# Altium project Smart Camera.PrjPcb (part 2 of 2)

## Sheet PoE FLYBACK.schdoc
size 510 x 296 mm
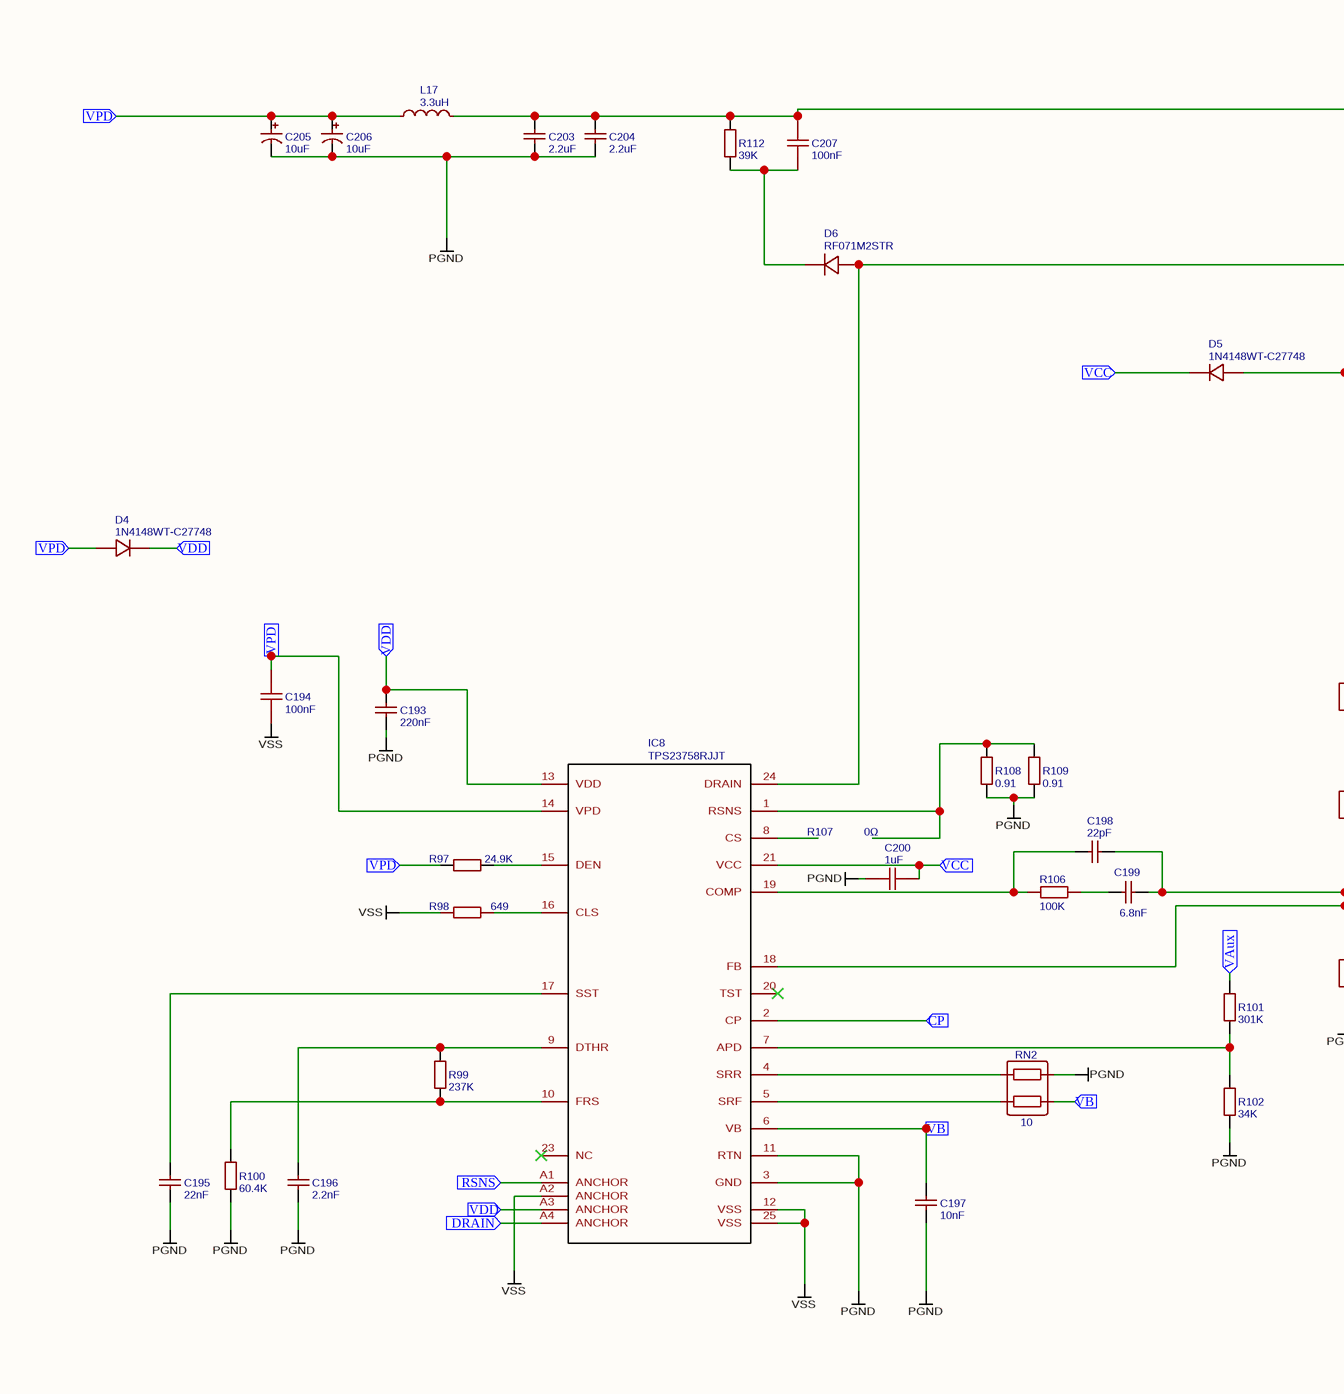
[diagram p11: PoE FLYBACK.schdoc, left]
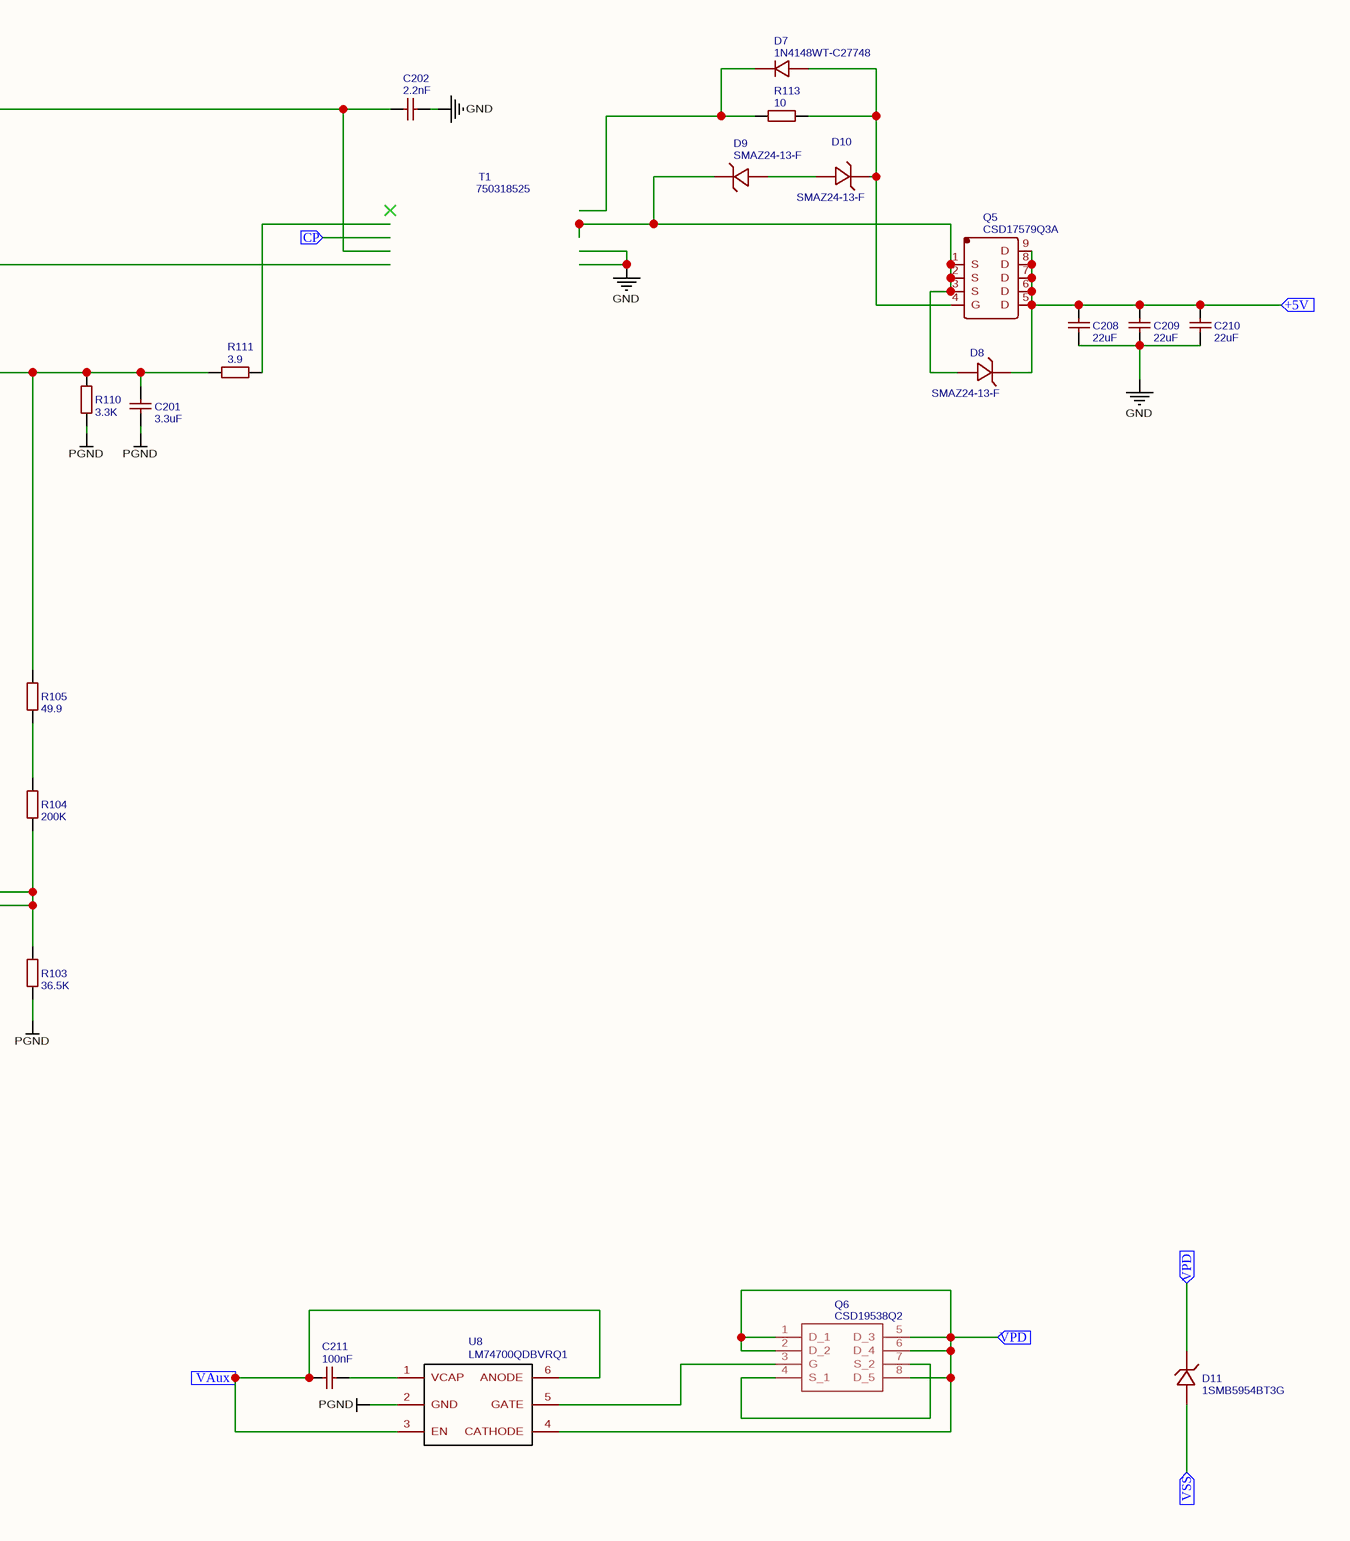
[diagram p12: PoE FLYBACK.schdoc, right]

### Parts
C193  220nF  [C0402]
C194  100nF  [C0603]
C195  22nF  [C0402]
C196  2.2nF  [C0402]
C197  10nF  [C0402]
C198  22pF  [C0402]
C199  6.8nF  [C0402]
C200  1uF  [C1206]
C201  3.3uF  [C0603]
C202  2.2nF  [C1206]
C203  2.2uF  [C1210]
C204  2.2uF  [C1210]
C205  10uF  [CAP-SMD_BD6.3-L6.6-W6.6-FD]
C206  10uF  [CAP-SMD_BD6.3-L6.6-W6.6-FD]
C207  100nF  [C0603]
C208  22uF  [C1206]
C209  22uF  [C1206]
C210  22uF  [C1206]
C211  100nF  [C0603]
D4  1N4148WT-C27748  [SOD-523_L1.2-W0.8-LS1.6-RD]
D5  1N4148WT-C27748  [SOD-523_L1.2-W0.8-LS1.6-RD]
D6  RF071M2STR  [SOD-123_L2.8-W1.8-LS3.7-RD]
D7  1N4148WT-C27748  [SOD-523_L1.2-W0.8-LS1.6-RD]
D8  SMAZ24-13-F  [SMA_L4.4-W2.6-LS5.0-RD]
D9  SMAZ24-13-F  [SMA_L4.4-W2.6-LS5.0-RD]
D10  SMAZ24-13-F  [SMA_L4.4-W2.6-LS5.0-RD]
D11  1SMB5954BT3G  [SMB_L4.6-W3.6-LS5.3-RD]
IC8  TPS23758RJJT  [TPS23758RJJT]
L17  3.3uH  [L0402]
Q5  CSD17579Q3A  [SON-8_L3.0-W3.1-P0.65-BP-EP]
Q6  CSD19538Q2  [CSD16301Q2]
R97  24.9K  [R0402]
R98  649  [R0402]
R99  237K  [R0402]
R100  60.4K  [R0402]
R101  301K  [R0402]
R102  34K  [R0402]
R103  36.5K  [R0402]
R104  200K  [R0402]
R105  49.9  [R0402]
R106  100K  [R0402]
R107  0Ω  [1206]
R108  0.91  [R0603]
R109  0.91  [R0603]
R110  3.3K  [R0402]
R111  3.9  [R0402]
R112  39K  [R0402]
R113  10  [R0603]
RN2  10  [RES-ARRAY-SMD_0402-4P-L1.0-W1.0-BL]
T1  750318525  [750318525]
U8  LM74700QDBVRQ1  [SOT-23-6]

### Ports
+5V (in), CP (in), DRAIN (in), RSNS (in), VAux (in), VB (in), VCC (in), VDD (in), VPD (in), VSS (in)

### Nets
GND: C202.2 C208.1 C209.1 C210.1
PGND: C193.1 C195.1 C196.1 C197.1 C200.2 C201.1 C203.1 C204.1 C205.2 C206.2 IC8.3(GND) IC8.11(RTN) R100.1 R102.1 R103.1 R108.1 R109.1 R110.1 RN2.4 U8.2(GND)
VSS: C194.1 IC8.12(VSS) IC8.25(VSS) IC8.A2(ANCHOR) R98.1
NetBR3_1: C194.2 C205.1 C206.1 D4.2(A) D11.1(C) IC8.14(VPD) L17.1 Q6.1(D_1) Q6.2(D_2) Q6.5(D_3) Q6.6(D_4) Q6.8(D_5) R97.1 U8.4(CATHODE) ; port VPD
NetC193_2: C193.2 D4.1(K) IC8.13(VDD) IC8.A3(ANCHOR) ; port VDD
NetC195_2: C195.2 IC8.17(SST)
NetC196_2: C196.2 IC8.9(DTHR) R99.2
NetC197_2: C197.2 IC8.6(VB) RN2.3 ; port VB
NetC198_1: C198.1 IC8.19(COMP) R106.1
NetC198_2: C198.2 C199.2 IC8.18(FB) R103.2 R104.1
NetC199_1: C199.1 R106.2
NetC200_1: C200.1 D5.1(K) IC8.21(VCC) ; port VCC
NetC201_2: C201.2 D5.2(A) R105.2 R110.2 R111.1
NetC202_1: C202.1 C203.2 C204.2 C207.2 L17.2 R112.2
NetC207_1: C207.1 D6.1(C) R112.1
NetC208_2: C208.2 C209.2 C210.2 D8.1(K) Q5.5(D) Q5.6(D) Q5.7(D) Q5.8(D) Q5.9(D) ; port +5V
NetC211_1: C211.1 R101.2 U8.3(EN) U8.6(ANODE) ; port VAux
NetC211_2: C211.2 U8.1(VCAP)
NetD6_2: D6.2(A) IC8.24(DRAIN)
NetD7_1: D7.1(K) R113.1
NetD7_2: D7.2(A) D10.1(K) Q5.4(G) R113.2
NetD8_2: D8.2(A) D9.1(K) Q5.1(S) Q5.2(S) Q5.3(S)
NetD9_2: D9.2(A) D10.2(A)
NetD11_2: D11.2(A) ; port VSS
NetIC8_1: IC8.1(RSNS) R108.2 R109.2
NetIC8_2: IC8.2(CP) ; port CP
NetIC8_4: IC8.4(SRR) RN2.1
NetIC8_5: IC8.5(SRF) RN2.2
NetIC8_7: IC8.7(APD) R101.1 R102.2
NetIC8_10: IC8.10(FRS) R99.1 R100.2
NetIC8_15: IC8.15(DEN) R97.2
NetIC8_16: IC8.16(CLS) R98.2
NetIC8_A1: IC8.A1(ANCHOR) ; port RSNS
NetIC8_A4: IC8.A4(ANCHOR) ; port DRAIN
NetQ6_3: Q6.3(G) U8.5(GATE)
NetQ6_4: Q6.4(S_1) Q6.7(S_2)
NetR104_2: R104.2 R105.1

Not connected (* = marked no-connect by the designer): IC8 8(CS) 20(TST)* 23(NC)*; R111 2

### Library data of the parts
C193 = 220nF: BOM_Manufacturer Part: CL05A224KA5NNNC; BOM_Manufacturer: SAMSUNG; nameAlias: Capacitance; SMT Type: Extend; BOM_Supplier: LCSC; BOM_Supplier Part: C47129; BOM_JLCPCB SMD: Yes; spicePre: C; spiceSymbolName: CL05A224KA5NNNC
C194 C207 = 100nF: BOM_Manufacturer: SAMSUNG; BOM_Manufacturer Part: CL10B104KC8NNNC; nameAlias: Capacitance; SMT Type: Extend; BOM_Supplier: LCSC; BOM_Supplier Part: C15725; BOM_JLCPCB SMD: Yes; spicePre: C; spiceSymbolName: CL10B104KC8NNNC
C195 = 22nF: BOM_Manufacturer: FH; BOM_Manufacturer Part: 0402B223K500NT; nameAlias: Capacitance; SMT Type: Basic; BOM_Supplier: LCSC; BOM_Supplier Part: C1532; BOM_JLCPCB SMD: Yes; spicePre: C; spiceSymbolName: 0402B223K500NT
C196 = 2.2nF: BOM_Manufacturer: FH; BOM_Manufacturer Part: 0402B222K500NT; nameAlias: Capacitance; SMT Type: Basic; BOM_Supplier: LCSC; BOM_Supplier Part: C1531; BOM_JLCPCB SMD: Yes; spicePre: C; spiceSymbolName: 0402B222K500NT
C197 = 10nF: BOM_Manufacturer Part: CL05B103KB5NNNC; BOM_Manufacturer: SAMSUNG; nameAlias: Capacitance; SMT Type: Basic; BOM_Supplier: LCSC; BOM_Supplier Part: C15195; BOM_JLCPCB SMD: Yes; spicePre: C; spiceSymbolName: CL05B103KB5NNNC
C198 = 22pF: BOM_Manufacturer: FH; BOM_Manufacturer Part: 0402CG220J500NT; nameAlias: Capacitance; SMT Type: Basic; BOM_Supplier: LCSC; BOM_Supplier Part: C1555; BOM_JLCPCB SMD: Yes; spicePre: C; spiceSymbolName: 0402CG220J500NT
C199 = 6.8nF: BOM_Manufacturer: FH; BOM_Manufacturer Part: 0402B682K500NT; nameAlias: Capacitance; SMT Type: Basic; BOM_Supplier: LCSC; BOM_Supplier Part: C1542; BOM_JLCPCB SMD: Yes; spicePre: C; spiceSymbolName: 0402B682K500NT
C200 = 1uF: BOM_Manufacturer: SAMSUNG; BOM_Manufacturer Part: CL31B105KCHNNNE; nameAlias: Capacitance; SMT Type: Extend; BOM_Supplier: LCSC; BOM_Supplier Part: C13832; BOM_JLCPCB SMD: Yes; spicePre: C; spiceSymbolName: CL31B105KCHNNNE
C201 = 3.3uF: BOM_Manufacturer Part: CL10A335KP8NNNC; BOM_Manufacturer: SAMSUNG; nameAlias: Capacitance; SMT Type: Extend; BOM_Supplier: LCSC; BOM_Supplier Part: C51412; BOM_JLCPCB SMD: Yes; spicePre: C; spiceSymbolName: CL10A335KP8NNNC
C202 = 2.2nF: BOM_Manufacturer: FH; BOM_Manufacturer Part: 1206B222K202NT; nameAlias: Capacitance; SMT Type: Extend; BOM_Supplier: LCSC; BOM_Supplier Part: C41018; BOM_JLCPCB SMD: Yes; spicePre: C; spiceSymbolName: 1206B222K202NT
C203 C204 = 2.2uF: BOM_Manufacturer Part: CL32B225KCJSNNE; BOM_Manufacturer: SAMSUNG; nameAlias: Capacitance; BOM_Supplier: LCSC; BOM_Supplier Part: C55151; spicePre: C; spiceSymbolName: CL32B225KCJSNNE
C205 C206 = 10uF: BOM_Manufacturer: CHENGX; BOM_Manufacturer Part: UT2A100M0607VG; nameAlias: Capacitance; BOM_Supplier: LCSC; BOM_Supplier Part: C82005; spicePre: C; spiceSymbolName: UT2A100M0607VG
C208-C210 = 22uF: BOM_Manufacturer Part: CL31A226KAHNNNE; BOM_Manufacturer: SAMSUNG; nameAlias: Capacitance; SMT Type: Extend; BOM_Supplier: LCSC; BOM_Supplier Part: C12891; BOM_JLCPCB SMD: Yes; spicePre: C; spiceSymbolName: CL31A226KAHNNNE
C211 = 100nF: BOM_Manufacturer Part: CL10B104JB8NNNC; BOM_Manufacturer: SAMSUNG; nameAlias: Capacitance; SMT Type: Extend; BOM_Supplier: LCSC; BOM_Supplier Part: C24452; BOM_JLCPCB SMD: Yes; spicePre: C; spiceSymbolName: CL10B104JB8NNNC
D4 D5 D7 = 1N4148WT-C27748: BOM_Manufacturer: SEMTECH; SMT Type: Extend; BOM_Supplier: LCSC; BOM_Manufacturer Part: 1N4148WT; image: //image.lceda.cn/szlcsc/C27748.jpg; BOM_Supplier Part: C27748; BOM_JLCPCB SMD: Yes; spicePre: D; spiceSymbolName: 1N4148WT-C27748
D6 = RF071M2STR: BOM_Manufacturer: ROHM; SMT Type: Extend; BOM_Supplier: LCSC; BOM_Manufacturer Part: RF071M2STR; image: //image.lceda.cn/szlcsc/C84978.jpg; BOM_Supplier Part: C84978; BOM_JLCPCB SMD: Yes; spicePre: D; spiceSymbolName: RF071M2STR
D8-D10 = SMAZ24-13-F: BOM_Manufacturer: Diodes Incorporated; Contributor: LCSC; SMT Type: Extend; BOM_Supplier: LCSC; BOM_Supplier Part: C155317; BOM_Manufacturer Part: SMAZ24-13-F; BOM_JLCPCB SMD: Yes; spicePre: D; spiceSymbolName: SMAZ24-13-F
D11 = 1SMB5954BT3G: BOM_Manufacturer: ON Semicon; Contributor: LCSC; SMT Type: Extend; BOM_Supplier: LCSC; BOM_Supplier Part: C235980; BOM_Manufacturer Part: 1SMB5954BT3G; BOM_JLCPCB SMD: Yes; spicePre: D; spiceSymbolName: 1SMB5954BT3G
IC8 = TPS23758RJJT: Contributor: Ke'Ondrae_Mell; spicePre: I; spiceSymbolName: TPS23758RJJT
L17 = 3.3uH: BOM_Manufacturer Part: SDFL1005Q3R3KTF; BOM_Manufacturer: Sunlord; nameAlias: Inductance; SMT Type: Extend; BOM_Supplier: LCSC; BOM_Supplier Part: C84474; BOM_JLCPCB SMD: Yes; spicePre: L; spiceSymbolName: SDFL1005Q3R3KTF
Q5 = CSD17579Q3A: BOM_Manufacturer: Texas Instruments; Contributor: LCSC; BOM_Supplier: LCSC; BOM_Supplier Part: C97376; BOM_Manufacturer Part: CSD17579Q3A; spicePre: Q; spiceSymbolName: CSD17579Q3A
R97 = 24.9K: BOM_Manufacturer: UniOhm; BOM_Manufacturer Part: 0402WGF2492TCE; nameAlias: Resistance (Ohms); SMT Type: Extend; BOM_Supplier: LCSC; BOM_Supplier Part: C25874; BOM_JLCPCB SMD: Yes; spicePre: R; spiceSymbolName: 0402WGF2492TCE
R98 = 649: BOM_Manufacturer: Uniroyal Elec; BOM_Manufacturer Part: 0402WGF6490TCE; nameAlias: Resistance (Ohms); Contributor: LCSC; SMT Type: Extend; BOM_Supplier: LCSC; BOM_Supplier Part: C82294; BOM_JLCPCB SMD: Yes; spicePre: R; spiceSymbolName: 0402WGF6490TCE
R99 = 237K: BOM_Manufacturer: UniOhm; BOM_Manufacturer Part: 0402WGF2373TCE; nameAlias: Resistance (Ohms); SMT Type: Extend; BOM_Supplier: LCSC; BOM_Supplier Part: C27001; BOM_JLCPCB SMD: Yes; spicePre: R; spiceSymbolName: 0402WGF2373TCE
R100 = 60.4K: BOM_Manufacturer: UniOhm; BOM_Manufacturer Part: 0402WGF6042TCE; nameAlias: Resistance (Ohms); SMT Type: Extend; BOM_Supplier: LCSC; BOM_Supplier Part: C25911; BOM_JLCPCB SMD: Yes; spicePre: R; spiceSymbolName: 0402WGF6042TCE
R101 = 301K: BOM_Manufacturer: UniOhm; BOM_Manufacturer Part: 0402WGF3013TCE; nameAlias: Resistance (Ohms); SMT Type: Extend; BOM_Supplier: LCSC; BOM_Supplier Part: C25775; BOM_JLCPCB SMD: Yes; spicePre: R; spiceSymbolName: 0402WGF3013TCE
R102 = 34K: BOM_Manufacturer: UniOhm; BOM_Manufacturer Part: 0402WGF3402TCE; nameAlias: Resistance (Ohms); SMT Type: Extend; BOM_Supplier: LCSC; BOM_Supplier Part: C48939; BOM_JLCPCB SMD: Yes; spicePre: R; spiceSymbolName: 0402WGF3402TCE
R103 = 36.5K: BOM_Manufacturer: UniOhm; BOM_Manufacturer Part: 0402WGF3652TCE; nameAlias: Resistance (Ohms); SMT Type: Extend; BOM_Supplier: LCSC; BOM_Supplier Part: C25887; BOM_JLCPCB SMD: Yes; spicePre: R; spiceSymbolName: 0402WGF3652TCE
R104 = 200K: BOM_Manufacturer: UniOhm; BOM_Manufacturer Part: 0402WGF2003TCE; nameAlias: Resistance (Ohms); SMT Type: Basic; BOM_Supplier: LCSC; BOM_Supplier Part: C25764; BOM_JLCPCB SMD: Yes; spicePre: R; spiceSymbolName: 0402WGF2003TCE
R105 = 49.9: BOM_Manufacturer: UniOhm; BOM_Manufacturer Part: 0402WGF499JTCE; nameAlias: Resistance (Ohms); SMT Type: Basic; BOM_Supplier: LCSC; BOM_Supplier Part: C25120; BOM_JLCPCB SMD: Yes; spicePre: R; spiceSymbolName: 0402WGF499JTCE
R106 = 100K: BOM_Manufacturer: Uniroyal Elec; BOM_Manufacturer Part: 0402WGD1003TCE; nameAlias: Resistance (Ohms); Contributor: LCSC; SMT Type: Extend; BOM_Supplier: LCSC; BOM_Supplier Part: C270658; BOM_JLCPCB SMD: Yes; spicePre: R; spiceSymbolName: 0402WGD1003TCE
R107 = 0Ω: BOM_Manufacturer Part: 0R(000) ±1%; Value: 0Ω; BOM_Supplier Part: undefined; BOM_Supplier: LCSC; spicePre: R; spiceSymbolName: 0Ω
R108 R109 = 0.91: BOM_Manufacturer: UniOhm; BOM_Manufacturer Part: 0603WAF910LT5E; nameAlias: Resistance (Ohms); SMT Type: Extend; BOM_Supplier: LCSC; BOM_Supplier Part: C27867; BOM_JLCPCB SMD: Yes; spicePre: R; spiceSymbolName: 0603WAF910LT5E
R110 = 3.3K: BOM_Manufacturer: UniOhm; BOM_Manufacturer Part: 0402WGF3301TCE; nameAlias: Resistance (Ohms); SMT Type: Basic; BOM_Supplier: LCSC; BOM_Supplier Part: C25890; BOM_JLCPCB SMD: Yes; spicePre: R; spiceSymbolName: 0402WGF3301TCE
R111 = 3.9: BOM_Manufacturer: UniOhm; BOM_Manufacturer Part: 0402WGF390KTCE; nameAlias: Resistance (Ohms); SMT Type: Extend; BOM_Supplier: LCSC; BOM_Supplier Part: C44937; BOM_JLCPCB SMD: Yes; spicePre: R; spiceSymbolName: 0402WGF390KTCE
R112 = 39K: BOM_Manufacturer: UniOhm; BOM_Manufacturer Part: 0402WGF3902TCE; nameAlias: Resistance (Ohms); SMT Type: Basic; BOM_Supplier: LCSC; BOM_Supplier Part: C25783; BOM_JLCPCB SMD: Yes; spicePre: R; spiceSymbolName: 0402WGF3902TCE
R113 = 10: BOM_Manufacturer: UniOhm; BOM_Manufacturer Part: TC0325B100JT5E; nameAlias: Resistance (Ohms); Contributor: LCSC; SMT Type: Extend; BOM_Supplier: LCSC; BOM_Supplier Part: C146565; BOM_JLCPCB SMD: Yes; spicePre: R; spiceSymbolName: TC0325B100JT5E
RN2 = 10: BOM_Manufacturer: Uniroyal Elec; BOM_Manufacturer Part: 2D02WGJ0100TCE; nameAlias: Resistance (Ohms); Contributor: LCSC; SMT Type: Extend; BOM_Supplier: LCSC; BOM_Supplier Part: C270394; BOM_JLCPCB SMD: Yes; spicePre: R; spiceSymbolName: 2D02WGJ0100TCE
U8 = LM74700QDBVRQ1: BOM_Manufacturer: Texas Instruments; Contributor: energybank; BOM_Manufacturer Part: LM74700QDBVRQ1; BOM_Supplier: Digi-Key; BOM_Supplier Part: 296-LM74700QDBVRQ1CT-ND; link: http://www.ti.com/general/docs/suppproductinfo.tsp?distId=10&gotoUrl=http%3A%2F%2Fwww.ti.com%2Flit%2Fgpn%2Flm74700-q1; spicePre: U; spiceSymbolName: LM74700QDBVRQ1
Q6 = CSD19538Q2: spicePre: Q; spiceSymbolName: CSD19538Q2
T1 = 750318525: spicePre: T; spiceSymbolName: 750318525

## Sheet PoE.schdoc
size 518 x 329 mm
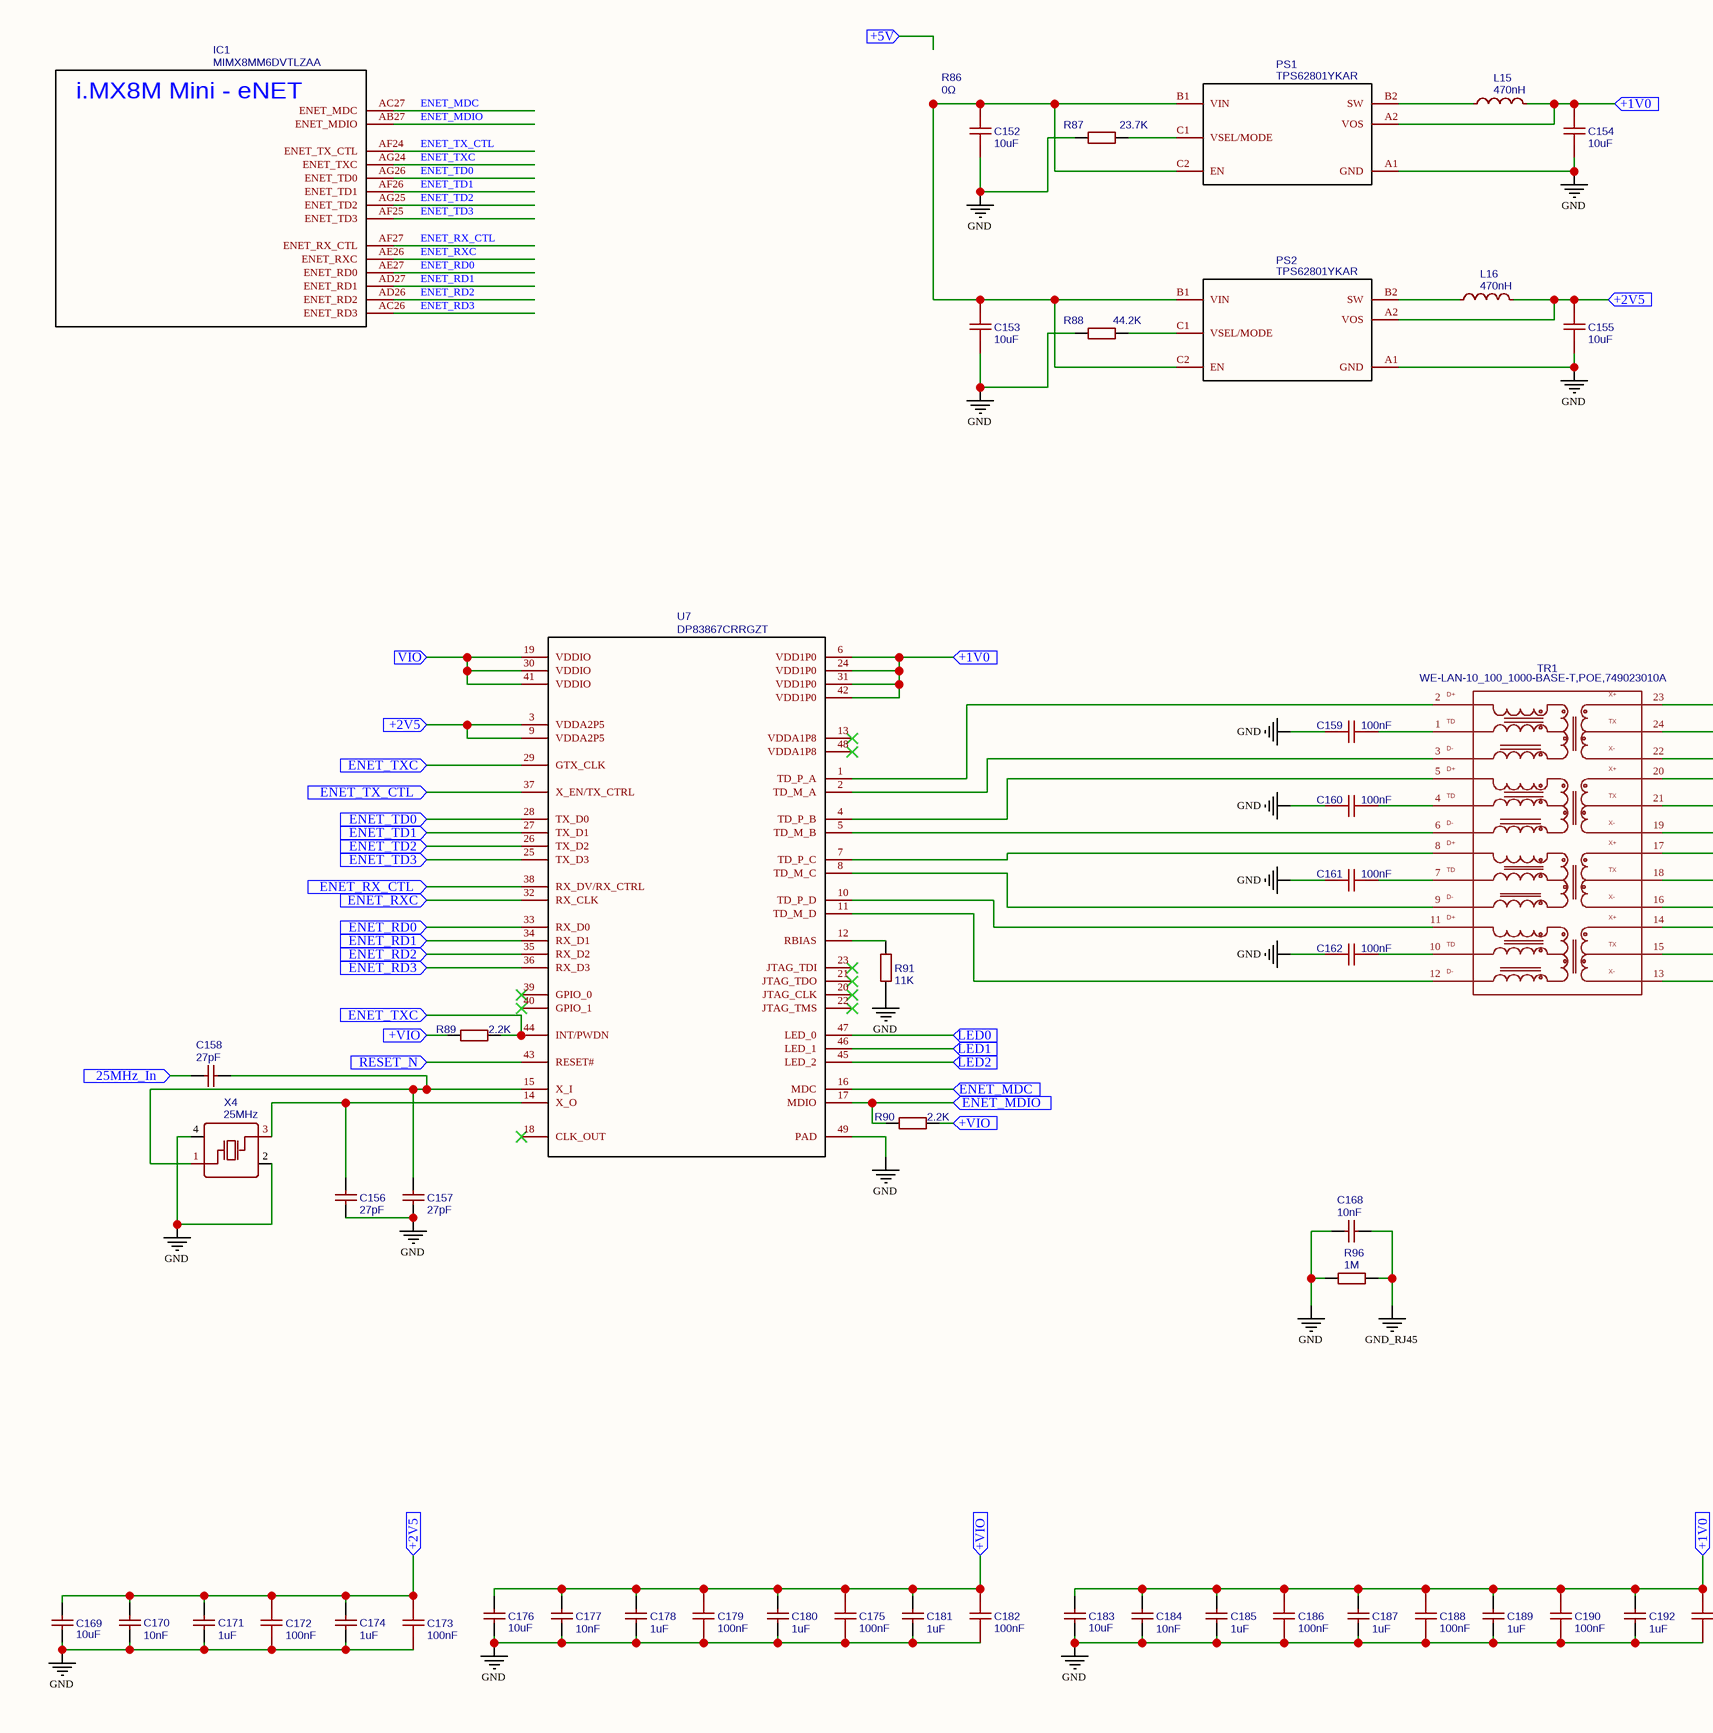
[diagram p13: PoE.schdoc, left]
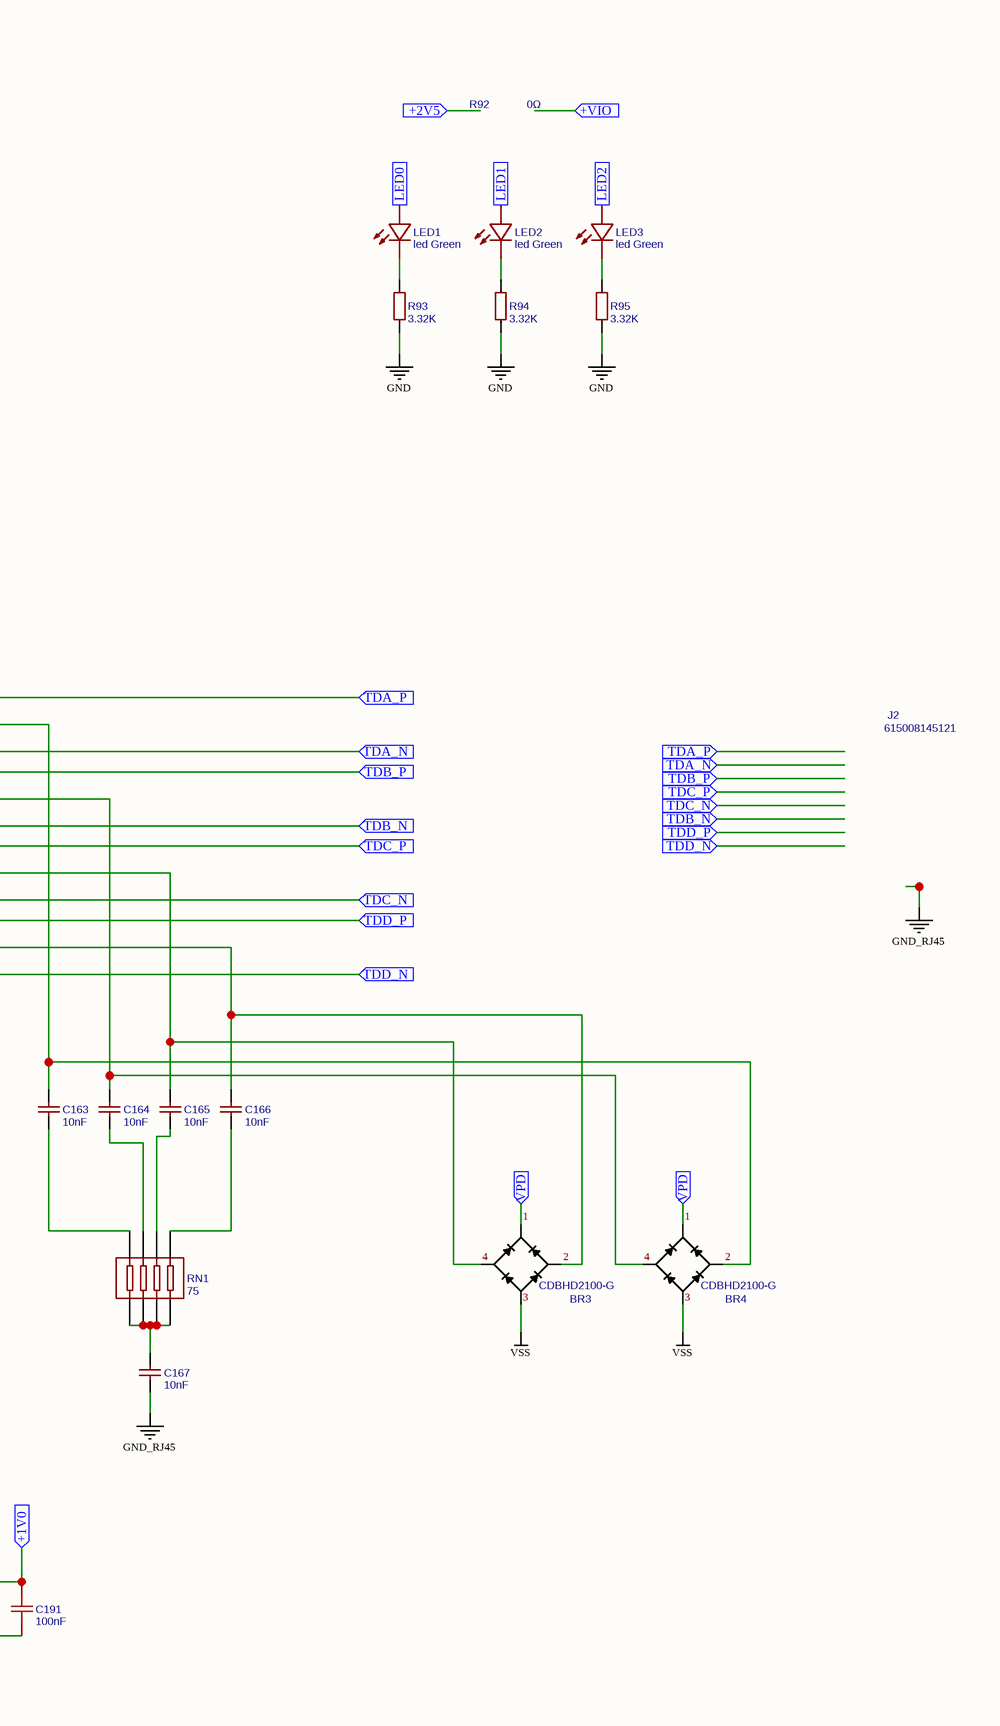
[diagram p14: PoE.schdoc, right]

### Parts
(Parts that share a designator on the sheet are numbered #1, #2 ... from top to bottom, then left to right.)
BR3  CDBHD2100-G  [SOP250P700X290-4N]
BR4  CDBHD2100-G  [SOP250P700X290-4N]
C152  10uF  [C1206]
C153  10uF  [C1206]
C154  10uF  [C1206]
C155  10uF  [C1206]
C156  27pF  [C0402]
C157  27pF  [C0402]
C158  27pF  [C0402]
C159  100nF  [C0603]
C160  100nF  [C0603]
C161  100nF  [C0603]
C162  100nF  [C0603]
C163  10nF  [C0805]
C164  10nF  [C0805]
C165  10nF  [C0805]
C166  10nF  [C0805]
C167  10nF  [C1206]
C168  10nF  [C1206]
C169  10uF  [C0402]
C170  10nF  [C0402]
C171  1uF  [C0603]
C172  100nF  [C0603]
C173  100nF  [C0603]
C174  1uF  [C0603]
C175  100nF  [C0603]
C176  10uF  [C0402]
C177  10nF  [C0402]
C178  1uF  [C0603]
C179  100nF  [C0603]
C180  1uF  [C0603]
C181  1uF  [C0603]
C182  100nF  [C0603]
C183  10uF  [C0402]
C184  10nF  [C0402]
C185  1uF  [C0603]
C186  100nF  [C0603]
C187  1uF  [C0603]
C188  100nF  [C0603]
C189  1uF  [C0603]
C190  100nF  [C0603]
C191  100nF  [C0603]
C192  1uF  [C0603]
IC1#11  MIMX8MM6DVTLZAA  [BGA486C50P27X27_1400X1400X125]
J2  615008145121  [615008145121]
L15  470nH  [L0603]
L16  470nH  [L0603]
LED1  led Green  [LED1206-RD]
LED2  led Green  [LED1206-RD]
LED3  led Green  [LED1206-RD]
PS1  TPS62801YKAR  [BGA6C35P2X3_70X105X40]
PS2  TPS62801YKAR  [BGA6C35P2X3_70X105X40]
R86  0Ω  [1206]
R87  23.7K  [R0402]
R88  44.2K  [R0402]
R89  2.2K  [R0402]
R90  2.2K  [R0402]
R91  11K  [R0402]
R92  0Ω  [1206]
R93  3.32K  [R0402]
R94  3.32K  [R0402]
R95  3.32K  [R0402]
R96  1M  [R0402]
RN1  75  [RES-ARRAY-SMD_0402-8P-L2.0-W1.0-BL]
TR1  WE-LAN-10_100_1000-BASE-T,POE,749023010A  [749023010A]
U7  DP83867CRRGZT  [QFN50P700X700X100-49N]
X4  25MHz  [OSC-SMD_4P-L3.2-W2.5-BL]

### Ports
25MHz_In (in), +1V0 (in), +2V5 (in), +5V (in), +VIO (in), ENET_MDC (in), ENET_MDIO (in), ENET_RD0 (in), ENET_RD1 (in), ENET_RD2 (in), ENET_RD3 (in), ENET_RX_CTL (in), ENET_RXC (in), ENET_TD0 (in), ENET_TD1 (in), ENET_TD2 (in), ENET_TD3 (in), ENET_TX_CTL (in), ENET_TXC (in), LED0 (in), LED1 (in), LED2 (in), RESET_N (in), TDA_N (in), TDA_P (in), TDB_N (in), TDB_P (in), TDC_N (in), TDC_P (in), TDD_N (in), TDD_P (in), VIO (in), VPD (in)

### Nets
GND: C152.1 C153.1 C154.1 C155.1 C156.1 C157.1 C159.1 C160.1 C161.1 C162.1 C168.2 C169.1 C170.1 C171.1 C172.1 C173.1 C174.1 C175.1 C176.1 C177.1 C178.1 C179.1 C180.1 C181.1 C182.1 C183.1 C184.1 C185.1 C186.1 C187.1 C188.1 C189.1 C190.1 C191.1 C192.1 PS1.A1(GND) PS2.A1(GND) R87.1 R88.1 R91.1 R93.1 R94.1 R95.1 R96.1 U7.49(PAD) X4.2(GND) X4.4(GND)
GND_RJ45: C167.1 C168.1 R96.2
VSS: BR3.3 BR4.3
ENET_MDC: IC1#11.AC27(ENET_MDC)
ENET_MDIO: IC1#11.AB27(ENET_MDIO)
ENET_RD0: IC1#11.AE27(ENET_RD0)
ENET_RD1: IC1#11.AD27(ENET_RD1)
ENET_RD2: IC1#11.AD26(ENET_RD2)
ENET_RD3: IC1#11.AC26(ENET_RD3)
ENET_RX_CTL: IC1#11.AF27(ENET_RX_CTL)
ENET_RXC: IC1#11.AE26(ENET_RXC)
ENET_TD0: IC1#11.AG26(ENET_TD0)
ENET_TD1: IC1#11.AF26(ENET_TD1)
ENET_TD2: IC1#11.AG25(ENET_TD2)
ENET_TD3: IC1#11.AF25(ENET_TD3)
ENET_TX_CTL: IC1#11.AF24(ENET_TX_CTL)
ENET_TXC: IC1#11.AG24(ENET_TXC)
NetBR3_1: BR3.1 BR4.1 ; port VPD
NetBR3_2: BR3.2 C166.2 TR1.15
NetBR3_4: BR3.4 C165.2 TR1.18
NetBR4_2: BR4.2 C163.2 TR1.24
NetBR4_4: BR4.4 C164.2 TR1.21
NetC152_2: C152.2 C153.2 PS1.B1(VIN) PS1.C2(EN) PS2.B1(VIN) PS2.C2(EN)
NetC154_2: C154.2 C183.2 C184.2 C185.2 C186.2 C187.2 C188.2 C189.2 C190.2 C191.2 C192.2 L15.2 PS1.A2(VOS) U7.6(VDD1P0) U7.24(VDD1P0) U7.31(VDD1P0) U7.42(VDD1P0) ; port +1V0
NetC155_2: C155.2 C169.2 C170.2 C171.2 C172.2 C173.2 C174.2 L16.2 PS2.A2(VOS) U7.3(VDDA2P5) U7.9(VDDA2P5) ; port +2V5
NetC156_2: C156.2 U7.14(X_O) X4.3(OSC2)
NetC157_2: C157.2 C158.1 U7.15(X_I) X4.1(OSC1)
NetC158_2: C158.2 ; port 25MHz_In
NetC159_2: C159.2 TR1.1
NetC160_2: C160.2 TR1.4
NetC161_2: C161.2 TR1.7
NetC162_2: C162.2 TR1.10
NetC163_1: C163.1 RN1.8
NetC164_1: C164.1 RN1.7
NetC165_1: C165.1 RN1.6
NetC166_1: C166.1 RN1.5
NetC167_2: C167.2 RN1.1 RN1.2 RN1.3 RN1.4
NetC175_2: C175.2 C176.2 C177.2 C178.2 C179.2 C180.2 C181.2 C182.2 R89.1 R90.2 ; port +VIO
NetL15_1: L15.1 PS1.B2(SW)
NetL16_1: L16.1 PS2.B2(SW)
NetLED1_1: LED1.1(-) R93.2
NetLED1_2: LED1.2(+) U7.47(LED_0) ; port LED0
NetLED2_1: LED2.1(-) R94.2
NetLED2_2: LED2.2(+) U7.46(LED_1) ; port LED1
NetLED3_1: LED3.1(-) R95.2
NetLED3_2: LED3.2(+) U7.45(LED_2) ; port LED2
NetPS1_C1: PS1.C1(VSEL/MODE) R87.2
NetPS2_C1: PS2.C1(VSEL/MODE) R88.2
NetR89_2: R89.2 U7.29(GTX_CLK) U7.44(INT/PWDN) ; port ENET_TXC
NetR90_1: R90.1 U7.17(MDIO) ; port ENET_MDIO
NetR91_2: R91.2 U7.12(RBIAS)
NetTR1_2: TR1.2 U7.1(TD_P_A)
NetTR1_3: TR1.3 U7.2(TD_M_A)
NetTR1_5: TR1.5 U7.4(TD_P_B)
NetTR1_6: TR1.6 U7.5(TD_M_B)
NetTR1_8: TR1.8 U7.7(TD_P_C)
NetTR1_9: TR1.9 U7.8(TD_M_C)
NetTR1_11: TR1.11 U7.10(TD_P_D)
NetTR1_12: TR1.12 U7.11(TD_M_D)
NetTR1_13: TR1.13 ; port TDD_N
NetTR1_14: TR1.14 ; port TDD_P
NetTR1_16: TR1.16 ; port TDC_N
NetTR1_17: TR1.17 ; port TDC_P
NetTR1_19: TR1.19 ; port TDB_N
NetTR1_20: TR1.20 ; port TDB_P
NetTR1_22: TR1.22 ; port TDA_N
NetTR1_23: TR1.23 ; port TDA_P
NetU7_16: U7.16(MDC) ; port ENET_MDC
NetU7_19: U7.19(VDDIO) U7.30(VDDIO) U7.41(VDDIO) ; port VIO
NetU7_25: U7.25(TX_D3) ; port ENET_TD3
NetU7_26: U7.26(TX_D2) ; port ENET_TD2
NetU7_27: U7.27(TX_D1) ; port ENET_TD1
NetU7_28: U7.28(TX_D0) ; port ENET_TD0
NetU7_32: U7.32(RX_CLK) ; port ENET_RXC
NetU7_33: U7.33(RX_D0) ; port ENET_RD0
NetU7_34: U7.34(RX_D1) ; port ENET_RD1
NetU7_35: U7.35(RX_D2) ; port ENET_RD2
NetU7_36: U7.36(RX_D3) ; port ENET_RD3
NetU7_37: U7.37(X_EN/TX_CTRL) ; port ENET_TX_CTL
NetU7_38: U7.38(RX_DV/RX_CTRL) ; port ENET_RX_CTL
NetU7_43: U7.43(RESET#) ; port RESET_N

Not connected (* = marked no-connect by the designer): U7 13(VDDA1P8)* 18(CLK_OUT)* 20(JTAG_CLK)* 21(JTAG_TDO)* 22(JTAG_TMS)* 23(JTAG_TDI)* 39(GPIO_0)* 40(GPIO_1)* 48(VDDA1P8)*

### Notes on the sheet
- (in symbol MIMX8MM6DVTLZAA) i.MX8M Mini - eNET
- (in symbol WE-LAN-10_100_1000-BASE-T,POE,749023010A) D+; X+; TD; TX; D-; X-

### Library data of the parts
BR3 BR4 = CDBHD2100-G: Contributor: Ke'Ondrae_Mell; BOM_Supplier: Mouser; spicePre: B; spiceSymbolName: CDBHD2100-G
C152-C155 = 10uF: BOM_Manufacturer: FH; BOM_Manufacturer Part: 1206B106K250NT; nameAlias: Capacitance; SMT Type: Extend; BOM_Supplier: LCSC; BOM_Supplier Part: C90538; BOM_JLCPCB SMD: Yes; spicePre: C; spiceSymbolName: 1206B106K250NT
C156-C158 = 27pF: BOM_Manufacturer: FH; BOM_Manufacturer Part: 0402CG270J500NTN; nameAlias: Capacitance; SMT Type: Basic; BOM_Supplier: LCSC; BOM_Supplier Part: C1557; BOM_JLCPCB SMD: Yes; spicePre: C; spiceSymbolName: 0402CG270J500NTN
C159-C162 = 100nF: as C194 on sheet PoE FLYBACK; BOM_Supplier: LCSC; BOM_Supplier Part: C15725; BOM_JLCPCB SMD: Yes; spicePre: C; spiceSymbolName: CL10B104KC8NNNC
C163-C166 = 10nF: BOM_Manufacturer Part: CL21B103KCANNNC; BOM_Manufacturer: SAMSUNG; nameAlias: Capacitance; SMT Type: Extend; BOM_Supplier: LCSC; BOM_Supplier Part: C18741; BOM_JLCPCB SMD: Yes; spicePre: C; spiceSymbolName: CL21B103KCANNNC
C167 C168 = 10nF: BOM_Manufacturer: FH; BOM_Manufacturer Part: 1206B103K202NT; nameAlias: Capacitance; SMT Type: Extend; BOM_Supplier: LCSC; BOM_Supplier Part: C53737; BOM_JLCPCB SMD: Yes; spicePre: C; spiceSymbolName: 1206B103K202NT
C169 C176 C183 = 10uF: BOM_Manufacturer Part: CL05A106MQ5NUNC; BOM_Manufacturer: SAMSUNG; nameAlias: Capacitance; SMT Type: Basic; BOM_Supplier: LCSC; BOM_Supplier Part: C15525; BOM_JLCPCB SMD: Yes; spicePre: C; spiceSymbolName: CL05A106MQ5NUNC
C170 C177 C184 = 10nF: as C197 on sheet PoE FLYBACK; BOM_Supplier: LCSC; BOM_Supplier Part: C15195; BOM_JLCPCB SMD: Yes; spicePre: C; spiceSymbolName: CL05B103KB5NNNC
C171 C174 C178 C180 C181 C185 C187 C189 C192 = 1uF: BOM_Manufacturer Part: CL10A105KA8NNNC; BOM_Manufacturer: SAMSUNG; nameAlias: Capacitance; SMT Type: Extend; BOM_Supplier: LCSC; BOM_Supplier Part: C5673; BOM_JLCPCB SMD: Yes; spicePre: C; spiceSymbolName: CL10A105KA8NNNC
C172 C173 C175 C179 C182 C186 C188 C190 C191 = 100nF: BOM_Manufacturer: YAGEO; BOM_Manufacturer Part: CC0603KRX7R9BB104; nameAlias: Capacitance; SMT Type: Basic; BOM_Supplier: LCSC; BOM_Supplier Part: C14663; BOM_JLCPCB SMD: Yes; spicePre: C; spiceSymbolName: CC0603KRX7R9BB104
IC1#11 = MIMX8MM6DVTLZAA: as IC1#1 on sheet CAMERA; spicePre: I; spiceSymbolName: MIMX8MM6DVTLZAA
J2 = 615008145121: Contributor: Ke'Ondrae_Mell; spicePre: J; spiceSymbolName: 615008145121
L15 L16 = 470nH: BOM_Manufacturer: Sunlord; BOM_Manufacturer Part: SDCL1608CR47JTDF; nameAlias: Inductance; SMT Type: Extend; BOM_Supplier: LCSC; BOM_Supplier Part: C21307; BOM_JLCPCB SMD: Yes; spicePre: L; spiceSymbolName: SDCL1608CR47JTDF
LED1-LED3 = led Green: BOM_Manufacturer: KENTO; SMT Type: Extend; BOM_Supplier: LCSC; BOM_Manufacturer Part: led Green; image: //image.lceda.cn/szlcsc/C14641.jpg; BOM_Supplier Part: C14641; BOM_JLCPCB SMD: Yes; spicePre: L; spiceSymbolName: led Green
PS1 PS2 = TPS62801YKAR: Contributor: Ke'Ondrae_Mell; spicePre: P; spiceSymbolName: TPS62801YKAR
R86 R92 = 0Ω: BOM_Manufacturer Part: 0R(000) ±1%; Value: 0Ω; BOM_Supplier Part: undefined; BOM_Supplier: LCSC; spicePre: R; spiceSymbolName: 0Ω
R87 = 23.7K: BOM_Manufacturer: UniOhm; BOM_Manufacturer Part: 0402WGF2372TCE; nameAlias: Resistance (Ohms); SMT Type: Extend; BOM_Supplier: LCSC; BOM_Supplier Part: C82134; BOM_JLCPCB SMD: Yes; spicePre: R; spiceSymbolName: 0402WGF2372TCE
R88 = 44.2K: BOM_Manufacturer: UniOhm; BOM_Manufacturer Part: 0402WGF4422TCE; nameAlias: Resistance (Ohms); SMT Type: Extend; BOM_Supplier: LCSC; BOM_Supplier Part: C25895; BOM_JLCPCB SMD: Yes; spicePre: R; spiceSymbolName: 0402WGF4422TCE
R89 R90 = 2.2K: BOM_Manufacturer: UniOhm; BOM_Manufacturer Part: 0402WGF2201TCE; nameAlias: Resistance (Ohms); SMT Type: Basic; BOM_Supplier: LCSC; BOM_Supplier Part: C25879; BOM_JLCPCB SMD: Yes; spicePre: R; spiceSymbolName: 0402WGF2201TCE
R91 = 11K: BOM_Manufacturer: UniOhm; BOM_Manufacturer Part: 0402WGF1102TCE; nameAlias: Resistance (Ohms); SMT Type: Extend; BOM_Supplier: LCSC; BOM_Supplier Part: C25749; BOM_JLCPCB SMD: Yes; spicePre: R; spiceSymbolName: 0402WGF1102TCE
R93-R95 = 3.32K: BOM_Manufacturer: UniOhm; BOM_Manufacturer Part: 0402WGF3321TCE; nameAlias: Resistance (Ohms); SMT Type: Extend; BOM_Supplier: LCSC; BOM_Supplier Part: C60075; BOM_JLCPCB SMD: Yes; spicePre: R; spiceSymbolName: 0402WGF3321TCE
R96 = 1M: BOM_Manufacturer: UniOhm; BOM_Manufacturer Part: 0402WGF1004TCE; nameAlias: Resistance (Ohms); SMT Type: Basic; BOM_Supplier: LCSC; BOM_Supplier Part: C26083; BOM_JLCPCB SMD: Yes; spicePre: R; spiceSymbolName: 0402WGF1004TCE
RN1 = 75: BOM_Manufacturer: UniOhm; BOM_Manufacturer Part: 4D02WGJ0750TCE; nameAlias: Resistance (Ohms); SMT Type: Extend; BOM_Supplier: LCSC; BOM_Supplier Part: C39128; BOM_JLCPCB SMD: Yes; spicePre: R; spiceSymbolName: 4D02WGJ0750TCE
TR1 = WE-LAN-10_100_1000-BASE-T,POE,749023010A: description: LAN-Transformer WE-LAN 10101000 Base Tx; timeStamp: 1469625502; spicePre: T; spiceSymbolName: WE-LAN-10_100_1000-BASE-T,POE,749023010A
U7 = DP83867CRRGZT: Contributor: Ke'Ondrae_Mell; spicePre: U; spiceSymbolName: DP83867CRRGZT
X4 = 25MHz: BOM_Manufacturer: YXC; BOM_Manufacturer Part: X322525MSB4SI; nameAlias: Frequency; SMT Type: Extend; BOM_Supplier: LCSC; BOM_Supplier Part: C13740; BOM_JLCPCB SMD: Yes; spicePre: X; spiceSymbolName: X322525MSB4SI

## Sheet POWER.schdoc
size 521 x 279 mm
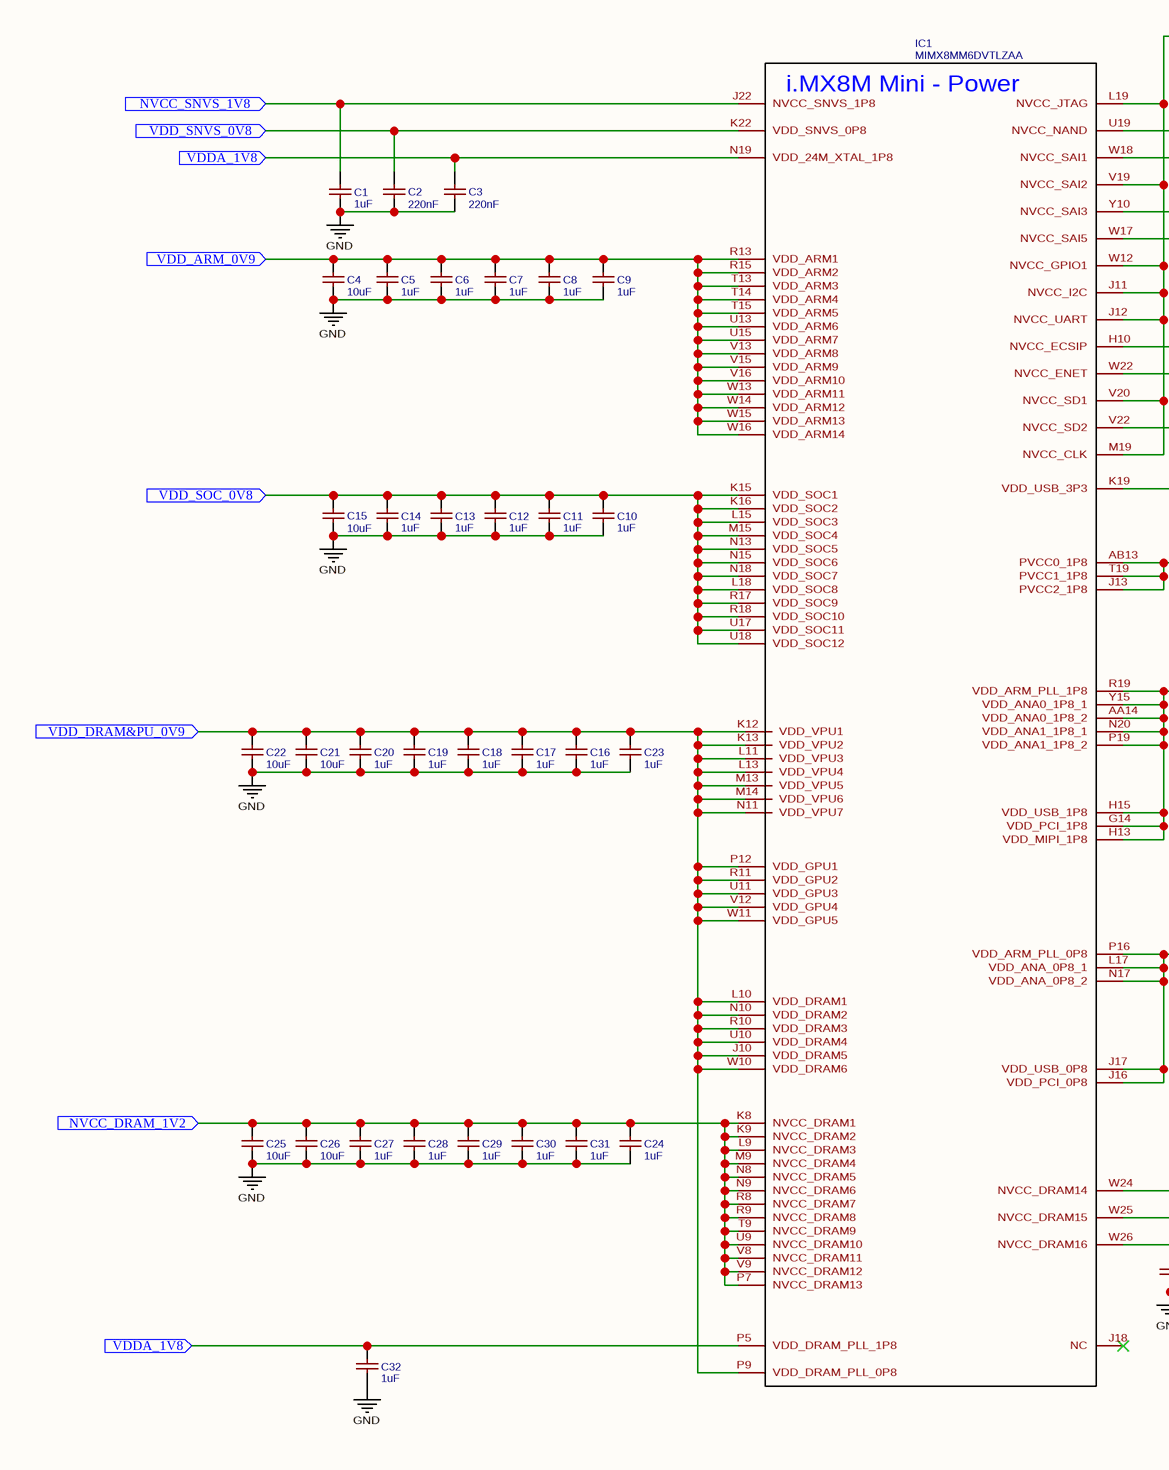
[diagram p15: POWER.schdoc, left]
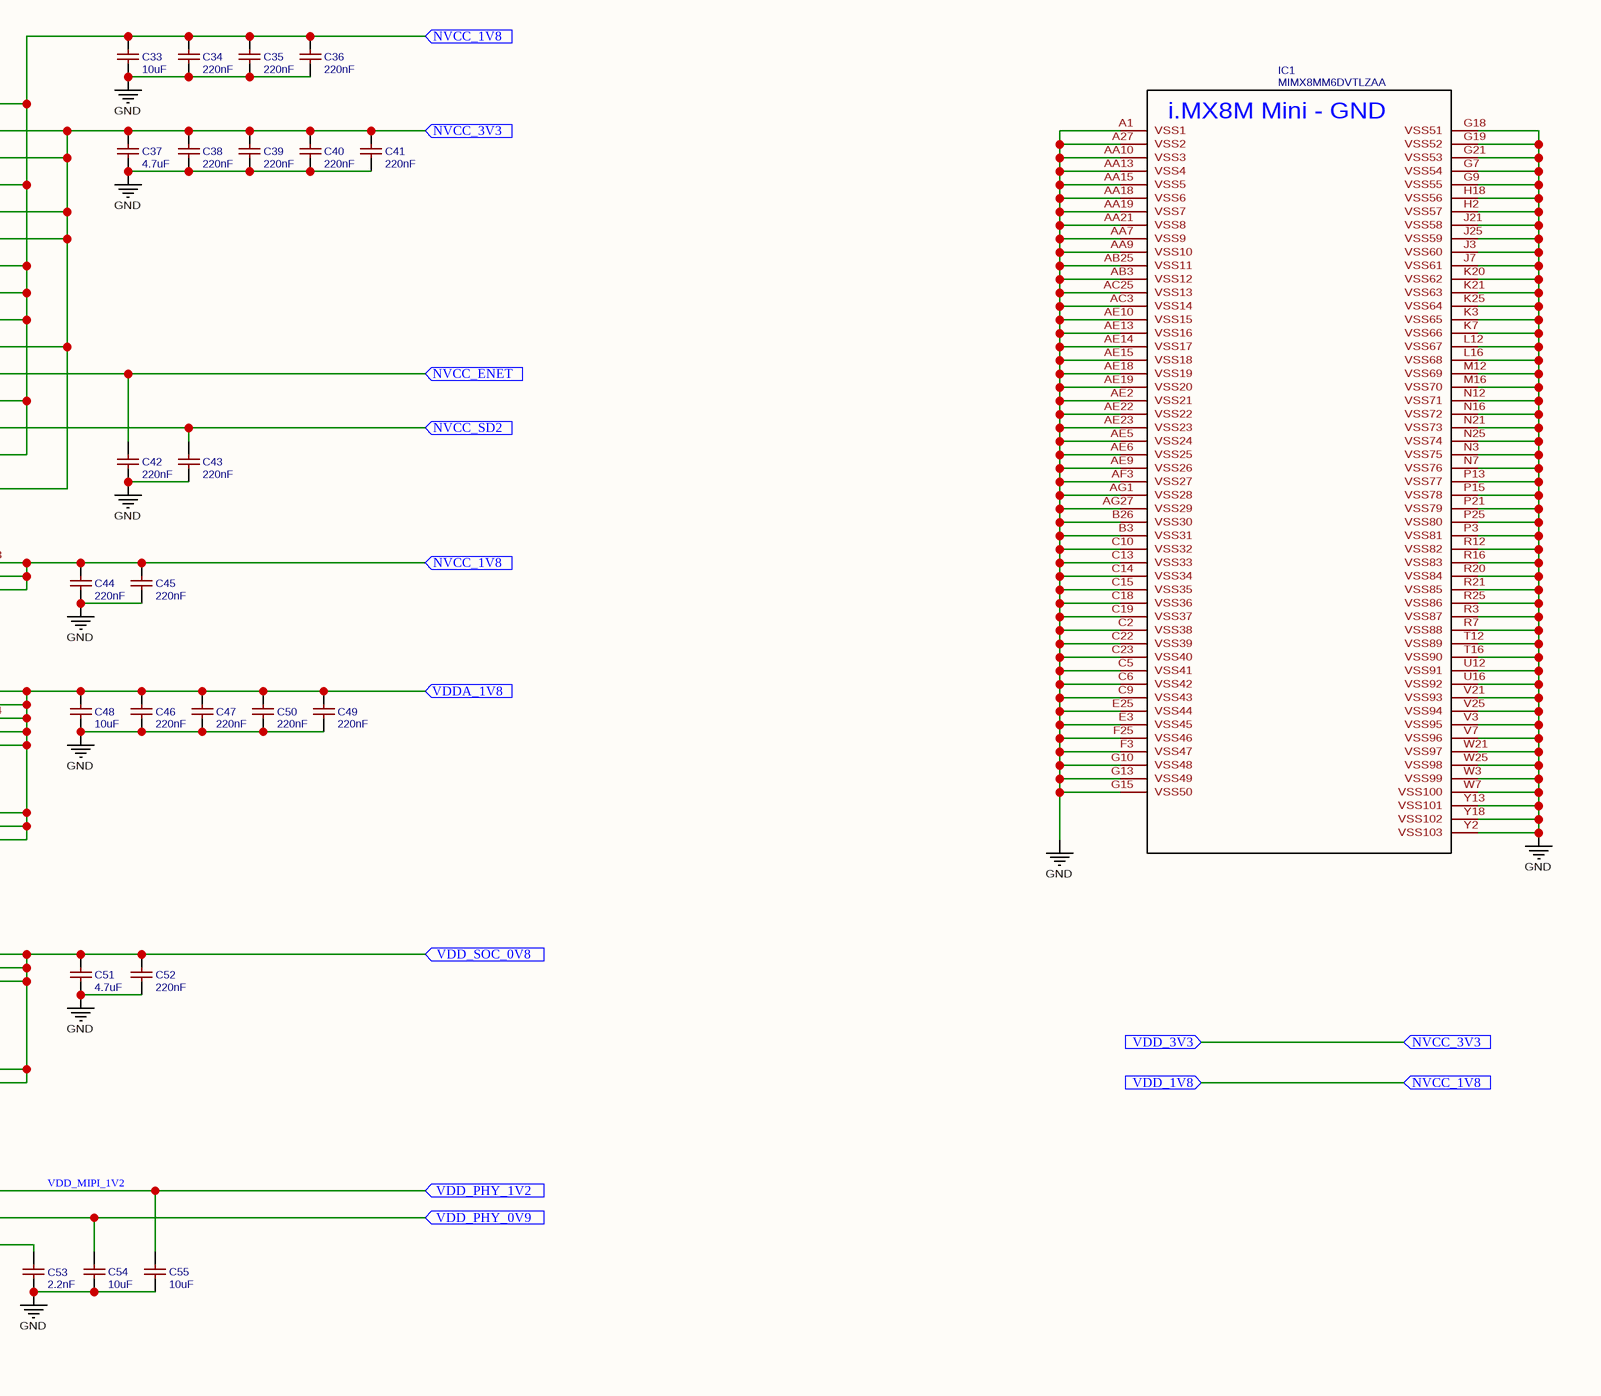
[diagram p16: POWER.schdoc, right]

### Parts
(Parts that share a designator on the sheet are numbered #1, #2 ... from top to bottom, then left to right.)
C1  1uF  [C0603]
C2  220nF  [C0805]
C3  220nF  [C0805]
C4  10uF  [C0402]
C5  1uF  [C0603]
C6  1uF  [C0603]
C7  1uF  [C0603]
C8  1uF  [C0603]
C9  1uF  [C0603]
C10  1uF  [C0603]
C11  1uF  [C0603]
C12  1uF  [C0603]
C13  1uF  [C0603]
C14  1uF  [C0603]
C15  10uF  [C0402]
C16  1uF  [C0603]
C17  1uF  [C0603]
C18  1uF  [C0603]
C19  1uF  [C0603]
C20  1uF  [C0603]
C21  10uF  [C0402]
C22  10uF  [C0402]
C23  1uF  [C0603]
C24  1uF  [C0603]
C25  10uF  [C0402]
C26  10uF  [C0402]
C27  1uF  [C0603]
C28  1uF  [C0603]
C29  1uF  [C0603]
C30  1uF  [C0603]
C31  1uF  [C0603]
C32  1uF  [C0603]
C33  10uF  [C0402]
C34  220nF  [C0805]
C35  220nF  [C0805]
C36  220nF  [C0805]
C37  4.7uF  [C0402]
C38  220nF  [C0805]
C39  220nF  [C0805]
C40  220nF  [C0805]
C41  220nF  [C0805]
C42  220nF  [C0805]
C43  220nF  [C0805]
C44  220nF  [C0805]
C45  220nF  [C0805]
C46  220nF  [C0805]
C47  220nF  [C0805]
C48  10uF  [C0402]
C49  220nF  [C0805]
C50  220nF  [C0805]
C51  4.7uF  [C0402]
C52  220nF  [C0805]
C53  2.2nF  [C0402]
C54  10uF  [C0402]
C55  10uF  [C0402]
IC1#12  MIMX8MM6DVTLZAA  [BGA486C50P27X27_1400X1400X125]
IC1#13  MIMX8MM6DVTLZAA  [BGA486C50P27X27_1400X1400X125]

### Ports
NVCC_1V8 (in), NVCC_3V3 (in), NVCC_DRAM_1V2 (in), NVCC_ENET (in), NVCC_SD2 (in), NVCC_SNVS_1V8 (in), VDD_1V8 (in), VDD_3V3 (in), VDD_ARM_0V9 (in), VDD_DRAM&PU_0V9 (in), VDD_PHY_0V9 (in), VDD_PHY_1V2 (in), VDD_SNVS_0V8 (in), VDD_SOC_0V8 (in), VDDA_1V8 (in)

### Nets
GND: C1.1 C2.1 C3.1 C4.1 C5.1 C6.1 C7.1 C8.1 C9.1 C10.1 C11.1 C12.1 C13.1 C14.1 C15.1 C16.1 C17.1 C18.1 C19.1 C20.1 C21.1 C22.1 C23.1 C24.1 C25.1 C26.1 C27.1 C28.1 C29.1 C30.1 C31.1 C32.1 C33.1 C34.1 C35.1 C36.1 C37.1 C38.1 C39.1 C40.1 C41.1 C42.1 C43.1 C44.1 C45.1 C46.1 C47.1 C48.1 C49.1 C50.1 C51.1 C52.1 C53.1 C54.1 C55.1 IC1#13.A1(VSS1) IC1#13.A27(VSS2) IC1#13.AA7(VSS9) IC1#13.AA9(VSS10) IC1#13.AA10(VSS3) IC1#13.AA13(VSS4) IC1#13.AA15(VSS5) IC1#13.AA18(VSS6) IC1#13.AA19(VSS7) IC1#13.AA21(VSS8) IC1#13.AB3(VSS12) IC1#13.AB25(VSS11) IC1#13.AC3(VSS14) IC1#13.AC25(VSS13) IC1#13.AE2(VSS21) IC1#13.AE5(VSS24) IC1#13.AE6(VSS25) IC1#13.AE9(VSS26) IC1#13.AE10(VSS15) IC1#13.AE13(VSS16) IC1#13.AE14(VSS17) IC1#13.AE15(VSS18) IC1#13.AE18(VSS19) IC1#13.AE19(VSS20) IC1#13.AE22(VSS22) IC1#13.AE23(VSS23) IC1#13.AF3(VSS27) IC1#13.AG1(VSS28) IC1#13.AG27(VSS29) IC1#13.B3(VSS31) IC1#13.B26(VSS30) IC1#13.C2(VSS38) IC1#13.C5(VSS41) IC1#13.C6(VSS42) IC1#13.C9(VSS43) IC1#13.C10(VSS32) IC1#13.C13(VSS33) IC1#13.C14(VSS34) IC1#13.C15(VSS35) IC1#13.C18(VSS36) IC1#13.C19(VSS37) IC1#13.C22(VSS39) IC1#13.C23(VSS40) IC1#13.E3(VSS45) IC1#13.E25(VSS44) IC1#13.F3(VSS47) IC1#13.F25(VSS46) IC1#13.G7(VSS54) IC1#13.G9(VSS55) IC1#13.G10(VSS48) IC1#13.G13(VSS49) IC1#13.G15(VSS50) IC1#13.G18(VSS51) IC1#13.G19(VSS52) IC1#13.G21(VSS53) IC1#13.H2(VSS57) IC1#13.H18(VSS56) IC1#13.J3(VSS60) IC1#13.J7(VSS61) IC1#13.J21(VSS58) IC1#13.J25(VSS59) IC1#13.K3(VSS65) IC1#13.K7(VSS66) IC1#13.K20(VSS62) IC1#13.K21(VSS63) IC1#13.K25(VSS64) IC1#13.L12(VSS67) IC1#13.L16(VSS68) IC1#13.M12(VSS69) IC1#13.M16(VSS70) IC1#13.N3(VSS75) IC1#13.N7(VSS76) IC1#13.N12(VSS71) IC1#13.N16(VSS72) IC1#13.N21(VSS73) IC1#13.N25(VSS74) IC1#13.P3(VSS81) IC1#13.P13(VSS77) IC1#13.P15(VSS78) IC1#13.P21(VSS79) IC1#13.P25(VSS80) IC1#13.R3(VSS87) IC1#13.R7(VSS88) IC1#13.R12(VSS82) IC1#13.R16(VSS83) IC1#13.R20(VSS84) IC1#13.R21(VSS85) IC1#13.R25(VSS86) IC1#13.T12(VSS89) IC1#13.T16(VSS90) IC1#13.U12(VSS91) IC1#13.U16(VSS92) IC1#13.V3(VSS95) IC1#13.V7(VSS96) IC1#13.V21(VSS93) IC1#13.V25(VSS94) IC1#13.W3(VSS99) IC1#13.W7(VSS100) IC1#13.W21(VSS97) IC1#13.W25(VSS98) IC1#13.Y2(VSS103) IC1#13.Y13(VSS101) IC1#13.Y18(VSS102)
VDD_MIPI_1V2: C55.2 IC1#12.W24(NVCC_DRAM14) ; port VDD_PHY_1V2
NetC1_2: C1.2 IC1#12.J22(NVCC_SNVS_1P8) ; port NVCC_SNVS_1V8
NetC2_2: C2.2 IC1#12.K22(VDD_SNVS_0P8) ; port VDD_SNVS_0V8
NetC3_2: C3.2 C32.2 C46.2 C47.2 C48.2 C49.2 C50.2 IC1#12.AA14(VDD_ANA0_1P8_2) IC1#12.G14(VDD_PCI_1P8) IC1#12.H13(VDD_MIPI_1P8) IC1#12.H15(VDD_USB_1P8) IC1#12.N19(VDD_24M_XTAL_1P8) IC1#12.N20(VDD_ANA1_1P8_1) IC1#12.P5(VDD_DRAM_PLL_1P8) IC1#12.P19(VDD_ANA1_1P8_2) IC1#12.R19(VDD_ARM_PLL_1P8) IC1#12.Y15(VDD_ANA0_1P8_1) ; port VDDA_1V8
NetC4_2: C4.2 C5.2 C6.2 C7.2 C8.2 C9.2 IC1#12.R13(VDD_ARM1) IC1#12.R15(VDD_ARM2) IC1#12.T13(VDD_ARM3) IC1#12.T14(VDD_ARM4) IC1#12.T15(VDD_ARM5) IC1#12.U13(VDD_ARM6) IC1#12.U15(VDD_ARM7) IC1#12.V13(VDD_ARM8) IC1#12.V15(VDD_ARM9) IC1#12.V16(VDD_ARM10) IC1#12.W13(VDD_ARM11) IC1#12.W14(VDD_ARM12) IC1#12.W15(VDD_ARM13) IC1#12.W16(VDD_ARM14) ; port VDD_ARM_0V9
NetC10_2: C10.2 C11.2 C12.2 C13.2 C14.2 C15.2 C51.2 C52.2 IC1#12.J16(VDD_PCI_0P8) IC1#12.J17(VDD_USB_0P8) IC1#12.K15(VDD_SOC1) IC1#12.K16(VDD_SOC2) IC1#12.L15(VDD_SOC3) IC1#12.L17(VDD_ANA_0P8_1) IC1#12.L18(VDD_SOC8) IC1#12.M15(VDD_SOC4) IC1#12.N13(VDD_SOC5) IC1#12.N15(VDD_SOC6) IC1#12.N17(VDD_ANA_0P8_2) IC1#12.N18(VDD_SOC7) IC1#12.P16(VDD_ARM_PLL_0P8) IC1#12.R17(VDD_SOC9) IC1#12.R18(VDD_SOC10) IC1#12.U17(VDD_SOC11) IC1#12.U18(VDD_SOC12) ; port VDD_SOC_0V8
NetC16_2: C16.2 C17.2 C18.2 C19.2 C20.2 C21.2 C22.2 C23.2 IC1#12.J10(VDD_DRAM5) IC1#12.K12(VDD_VPU1) IC1#12.K13(VDD_VPU2) IC1#12.L10(VDD_DRAM1) IC1#12.L11(VDD_VPU3) IC1#12.L13(VDD_VPU4) IC1#12.M13(VDD_VPU5) IC1#12.M14(VDD_VPU6) IC1#12.N10(VDD_DRAM2) IC1#12.N11(VDD_VPU7) IC1#12.P9(VDD_DRAM_PLL_0P8) IC1#12.P12(VDD_GPU1) IC1#12.R10(VDD_DRAM3) IC1#12.R11(VDD_GPU2) IC1#12.U10(VDD_DRAM4) IC1#12.U11(VDD_GPU3) IC1#12.V12(VDD_GPU4) IC1#12.W10(VDD_DRAM6) IC1#12.W11(VDD_GPU5) ; port VDD_DRAM&PU_0V9
NetC24_2: C24.2 C25.2 C26.2 C27.2 C28.2 C29.2 C30.2 C31.2 IC1#12.K8(NVCC_DRAM1) IC1#12.K9(NVCC_DRAM2) IC1#12.L9(NVCC_DRAM3) IC1#12.M9(NVCC_DRAM4) IC1#12.N8(NVCC_DRAM5) IC1#12.N9(NVCC_DRAM6) IC1#12.P7(NVCC_DRAM13) IC1#12.R8(NVCC_DRAM7) IC1#12.R9(NVCC_DRAM8) IC1#12.T9(NVCC_DRAM9) IC1#12.U9(NVCC_DRAM10) IC1#12.V8(NVCC_DRAM11) IC1#12.V9(NVCC_DRAM12) ; port NVCC_DRAM_1V2
NetC33_2: C33.2 C34.2 C35.2 C36.2 C44.2 C45.2 IC1#12.AB13(PVCC0_1P8) IC1#12.J11(NVCC_I2C) IC1#12.J12(NVCC_UART) IC1#12.J13(PVCC2_1P8) IC1#12.L19(NVCC_JTAG) IC1#12.M19(NVCC_CLK) IC1#12.T19(PVCC1_1P8) IC1#12.V19(NVCC_SAI2) IC1#12.V20(NVCC_SD1) IC1#12.W12(NVCC_GPIO1) ; port NVCC_1V8, port VDD_1V8
NetC37_2: C37.2 C38.2 C39.2 C40.2 C41.2 IC1#12.H10(NVCC_ECSIP) IC1#12.K19(VDD_USB_3P3) IC1#12.U19(NVCC_NAND) IC1#12.W17(NVCC_SAI5) IC1#12.W18(NVCC_SAI1) IC1#12.Y10(NVCC_SAI3) ; port VDD_3V3, port NVCC_3V3
NetC42_2: C42.2 IC1#12.W22(NVCC_ENET) ; port NVCC_ENET
NetC43_2: C43.2 IC1#12.V22(NVCC_SD2) ; port NVCC_SD2
NetC53_2: C53.2 IC1#12.W26(NVCC_DRAM16)
NetC54_2: C54.2 IC1#12.W25(NVCC_DRAM15) ; port VDD_PHY_0V9

Not connected (* = marked no-connect by the designer): IC1#12 J18(NC)*

### Notes on the sheet
- (in symbol MIMX8MM6DVTLZAA) i.MX8M Mini - GND; i.MX8M Mini - Power

### Library data of the parts
C1 C5-C14 C16-C20 C23 C24 C27-C32 = 1uF: BOM_Manufacturer Part: CL10A105KB8NNNC; BOM_Manufacturer: SAMSUNG; nameAlias: Capacitance; SMT Type: Basic; BOM_Supplier: LCSC; BOM_Supplier Part: C15849; BOM_JLCPCB SMD: Yes; spicePre: C; spiceSymbolName: CL10A105KB8NNNC
C2 C3 C34-C36 C38-C47 C49 C50 C52 = 220nF: BOM_Manufacturer: FH; BOM_Manufacturer Part: 0805F224M500NT; nameAlias: Capacitance; BOM_Supplier: LCSC; BOM_Supplier Part: C41051; spicePre: C; spiceSymbolName: 0805F224M500NT_C41051
C4 C15 C21 C22 C25 C26 C33 C48 C54 C55 = 10uF: BOM_Manufacturer Part: CL05A106MQ5NUNC; BOM_Manufacturer: SAMSUNG; nameAlias: Capacitance; SMT Type: Basic; BOM_Supplier: LCSC; BOM_Supplier Part: C15525; BOM_JLCPCB SMD: Yes; spicePre: C; spiceSymbolName: CL05A106MQ5NUNC
C37 C51 = 4.7uF: BOM_Manufacturer Part: CL05A475MP5NRNC; BOM_Manufacturer: SAMSUNG; nameAlias: Capacitance; SMT Type: Basic; BOM_Supplier: LCSC; BOM_Supplier Part: C23733; BOM_JLCPCB SMD: Yes; spicePre: C; spiceSymbolName: CL05A475MP5NRNC
C53 = 2.2nF: BOM_Manufacturer: FH; BOM_Manufacturer Part: 0402B222K500NT; nameAlias: Capacitance; SMT Type: Basic; BOM_Supplier: LCSC; BOM_Supplier Part: C1531; BOM_JLCPCB SMD: Yes; spicePre: C; spiceSymbolName: 0402B222K500NT
IC1#12 IC1#13 = MIMX8MM6DVTLZAA: subpart_no: 2; Contributor: Ke'Ondrae_Mell; spicePre: I; spiceSymbolName: MIMX8MM6DVTLZAA

## Sheet SYS_POWER.schdoc
size 478 x 239 mm
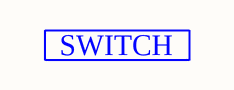
[diagram p17: SYS_POWER.schdoc]

### Ports
SWITCH (in)

## Sheet BT.schdoc
size 379 x 253 mm
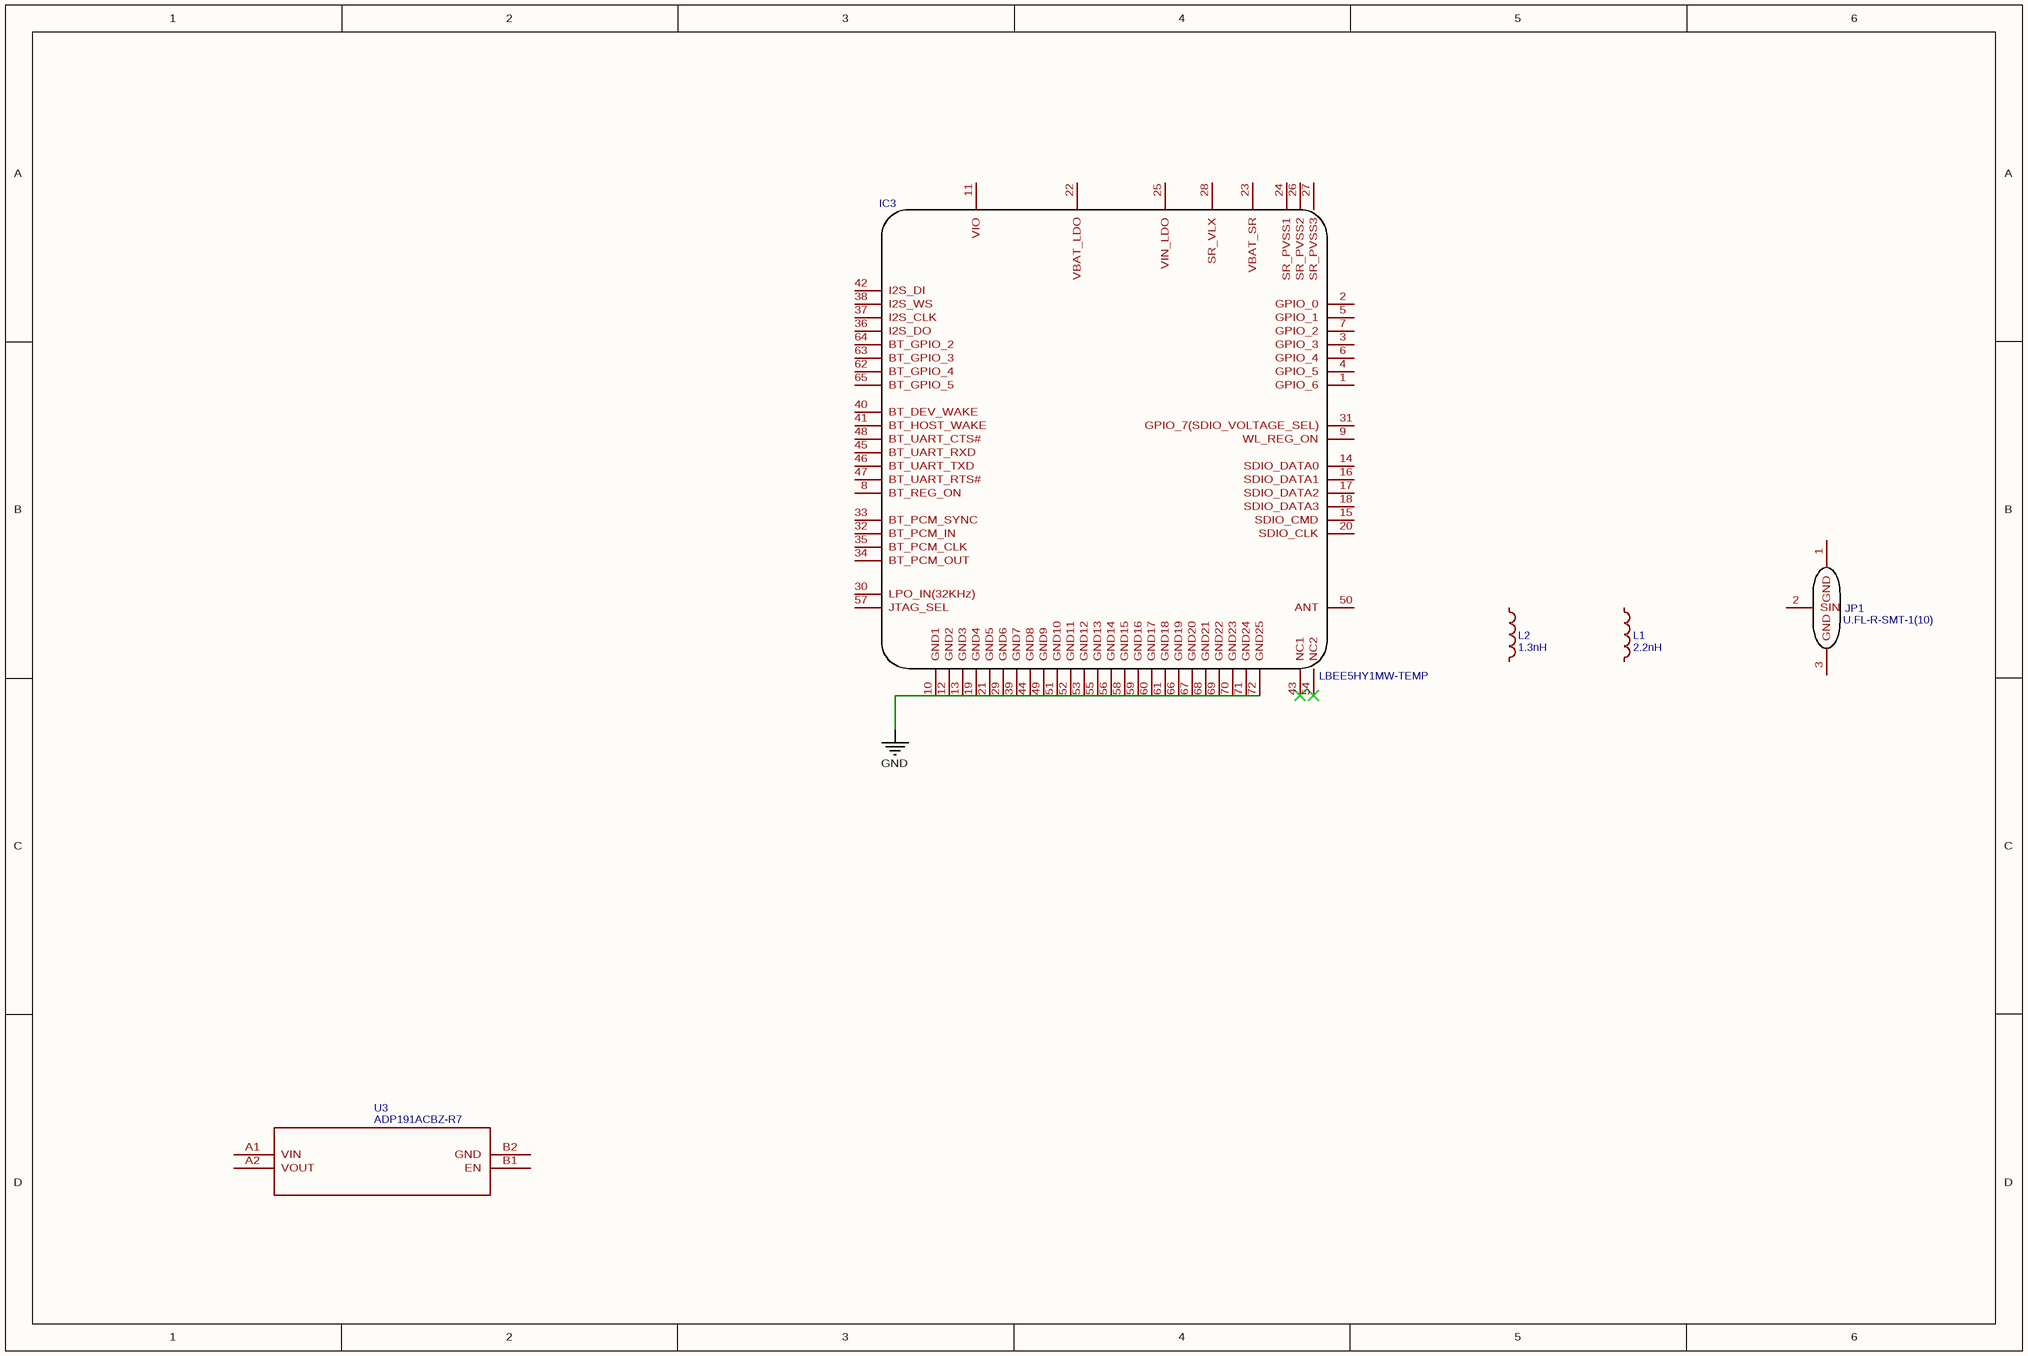
[diagram p18: BT.schdoc]

### Parts
IC3  LBEE5HY1MW-TEMP  [LBEE5HY1MWTEMP]
JP1  U.FL-R-SMT-1(10)  [ANT-SMD_UFL-R-SMT-1(10)]
L1  2.2nH  [L0805]
L2  1.3nH  [L0201]
U3  ADP191ACBZ-R7  [CB_4_3_ADI]

### Nets
GND: IC3.10(GND1) IC3.12(GND2) IC3.13(GND3) IC3.19(GND4) IC3.21(GND5) IC3.29(GND6) IC3.39(GND7) IC3.44(GND8) IC3.49(GND9) IC3.51(GND10) IC3.52(GND11) IC3.53(GND12) IC3.55(GND13) IC3.56(GND14) IC3.58(GND15) IC3.59(GND16) IC3.60(GND17) IC3.61(GND18) IC3.66(GND19) IC3.67(GND20) IC3.68(GND21) IC3.69(GND22) IC3.70(GND23) IC3.71(GND24) IC3.72(GND25)

Not connected (* = marked no-connect by the designer): IC3 1(GPIO_6) 2(GPIO_0) 3(GPIO_3) 4(GPIO_5) 5(GPIO_1) 6(GPIO_4) 7(GPIO_2) 8(BT_REG_ON) 9(WL_REG_ON) 11(VIO) 14(SDIO_DATA0) 15(SDIO_CMD) 16(SDIO_DATA1) 17(SDIO_DATA2) 18(SDIO_DATA3) 20(SDIO_CLK) 22(VBAT_LDO) 23(VBAT_SR) 24(SR_PVSS1) 25(VIN_LDO) 26(SR_PVSS2) 27(SR_PVSS3) 28(SR_VLX) 30(LPO_IN(32KHz)) 31(GPIO_7(SDIO_VOLTAGE_SEL)) 32(BT_PCM_IN) 33(BT_PCM_SYNC) 34(BT_PCM_OUT) 35(BT_PCM_CLK) 36(I2S_DO) 37(I2S_CLK) 38(I2S_WS) 40(BT_DEV_WAKE) 41(BT_HOST_WAKE) 42(I2S_DI) 43(NC1)* 45(BT_UART_RXD) 46(BT_UART_TXD) 47(BT_UART_RTS#) 48(BT_UART_CTS#) 50(ANT) 54(NC2)* 57(JTAG_SEL) 62(BT_GPIO_4) 63(BT_GPIO_3) 64(BT_GPIO_2) 65(BT_GPIO_5); JP1 1(GND) 2(SIN) 3(GND); L1 1 2; L2 1 2; U3 A1(VIN) A2(VOUT) B1(EN) B2(GND)

### Library data of the parts
IC3 = LBEE5HY1MW-TEMP: Contributor: Ke'Ondrae_Mell; spicePre: I; spiceSymbolName: LBEE5HY1MW-TEMP
JP1 = U.FL-R-SMT-1(10): BOM_Manufacturer: HRS; BOM_Supplier: LCSC; BOM_Manufacturer Part: U.FL-R-SMT-1(10); BOM_Supplier Part: C88373; spicePre: J; spiceSymbolName: U.FL-R-SMT-1(10)
L1 = 2.2nH: BOM_Manufacturer: FH; BOM_Manufacturer Part: VHF201209H2N2ST; nameAlias: Inductance; SMT Type: Extend; BOM_Supplier: LCSC; BOM_Supplier Part: C1037; BOM_JLCPCB SMD: Yes; spicePre: L; spiceSymbolName: VHF201209H2N2ST
L2 = 1.3nH: BOM_Manufacturer: TDK; BOM_Manufacturer Part: MLG0603P1N3BT000; nameAlias: Inductance; BOM_Supplier: LCSC; BOM_Supplier Part: C89432; spicePre: L; spiceSymbolName: MLG0603P1N3BT000
U3 = ADP191ACBZ-R7: Contributor: gmathey; spicePre: U; spiceSymbolName: ADP191ACBZ-R7

## Nets that join several sheets
GND: CAMERA (22 pins), CPU MISC (8 pins), DDR4 (53 pins), JTAG (JTAG1.3 JTAG1.5), NAND (IC7.13 IC7.25 IC7.36 IC7.48), PMIC (43 pins), PoE FLYBACK (C202.2 C208.1 C209.1 C210.1), PoE (47 pins), POWER (158 pins), BT (25 pins)
VSS: PoE FLYBACK (5 pins), PoE (BR3.3 BR4.3)
NetBR3_1: PoE FLYBACK (14 pins), PoE (BR3.1 BR4.1)
NetC1_2: CPU MISC (R21.2 R22.2 R23.2), PMIC (6 pins), POWER (C1.2 IC1#12.J22)
NetC2_2: PMIC (C95.1 TP24.1 U4#1.8), POWER (C2.2 IC1#12.K22)
NetC3_2: PMIC (C98.1 TP28.1 U4#1.6), POWER (17 pins)
NetC4_2: PMIC (5 pins), POWER (20 pins)
NetC10_2: PMIC (5 pins), POWER (25 pins)
NetC16_2: PMIC (5 pins), POWER (27 pins)
NetC24_2: DDR4 (47 pins), PMIC (5 pins), POWER (21 pins)
NetC33_2: CAMERA (Q4.3 X3.12), JTAG (D3.2 R79.2 R80.2 R82.1), NOT CONNECTED (8 pins), PMIC (11 pins), POWER (16 pins)
NetC37_2: CAMERA (C140.2 Q4.1 X3.15), NAND (9 pins), PMIC (8 pins), POWER (11 pins)
NetC43_2: NOT CONNECTED (R18.1 R19.1 R20.1), PMIC (C99.1 TP29.1 U4#1.55), POWER (C43.2 IC1#12.V22)
NetC54_2: PMIC (C96.1 TP26.1 U4#1.42), POWER (C54.2 IC1#12.W25)
NetC60_2: DDR4 (6 pins), PMIC (C106.2 TP30.1 U5.5)
POR_B: CPU MISC (IC1#2.B24 R22.1 TP2.1), JTAG (D2.2)
VDD_MIPI_1V2: PMIC (C97.1 TP27.1 U4#1.44), POWER (C55.2 IC1#12.W24)